# Altium project CC_V1.4.PrjPCB (part 2 of 2)

## Sheet CoreBoard.SchDoc
size A1
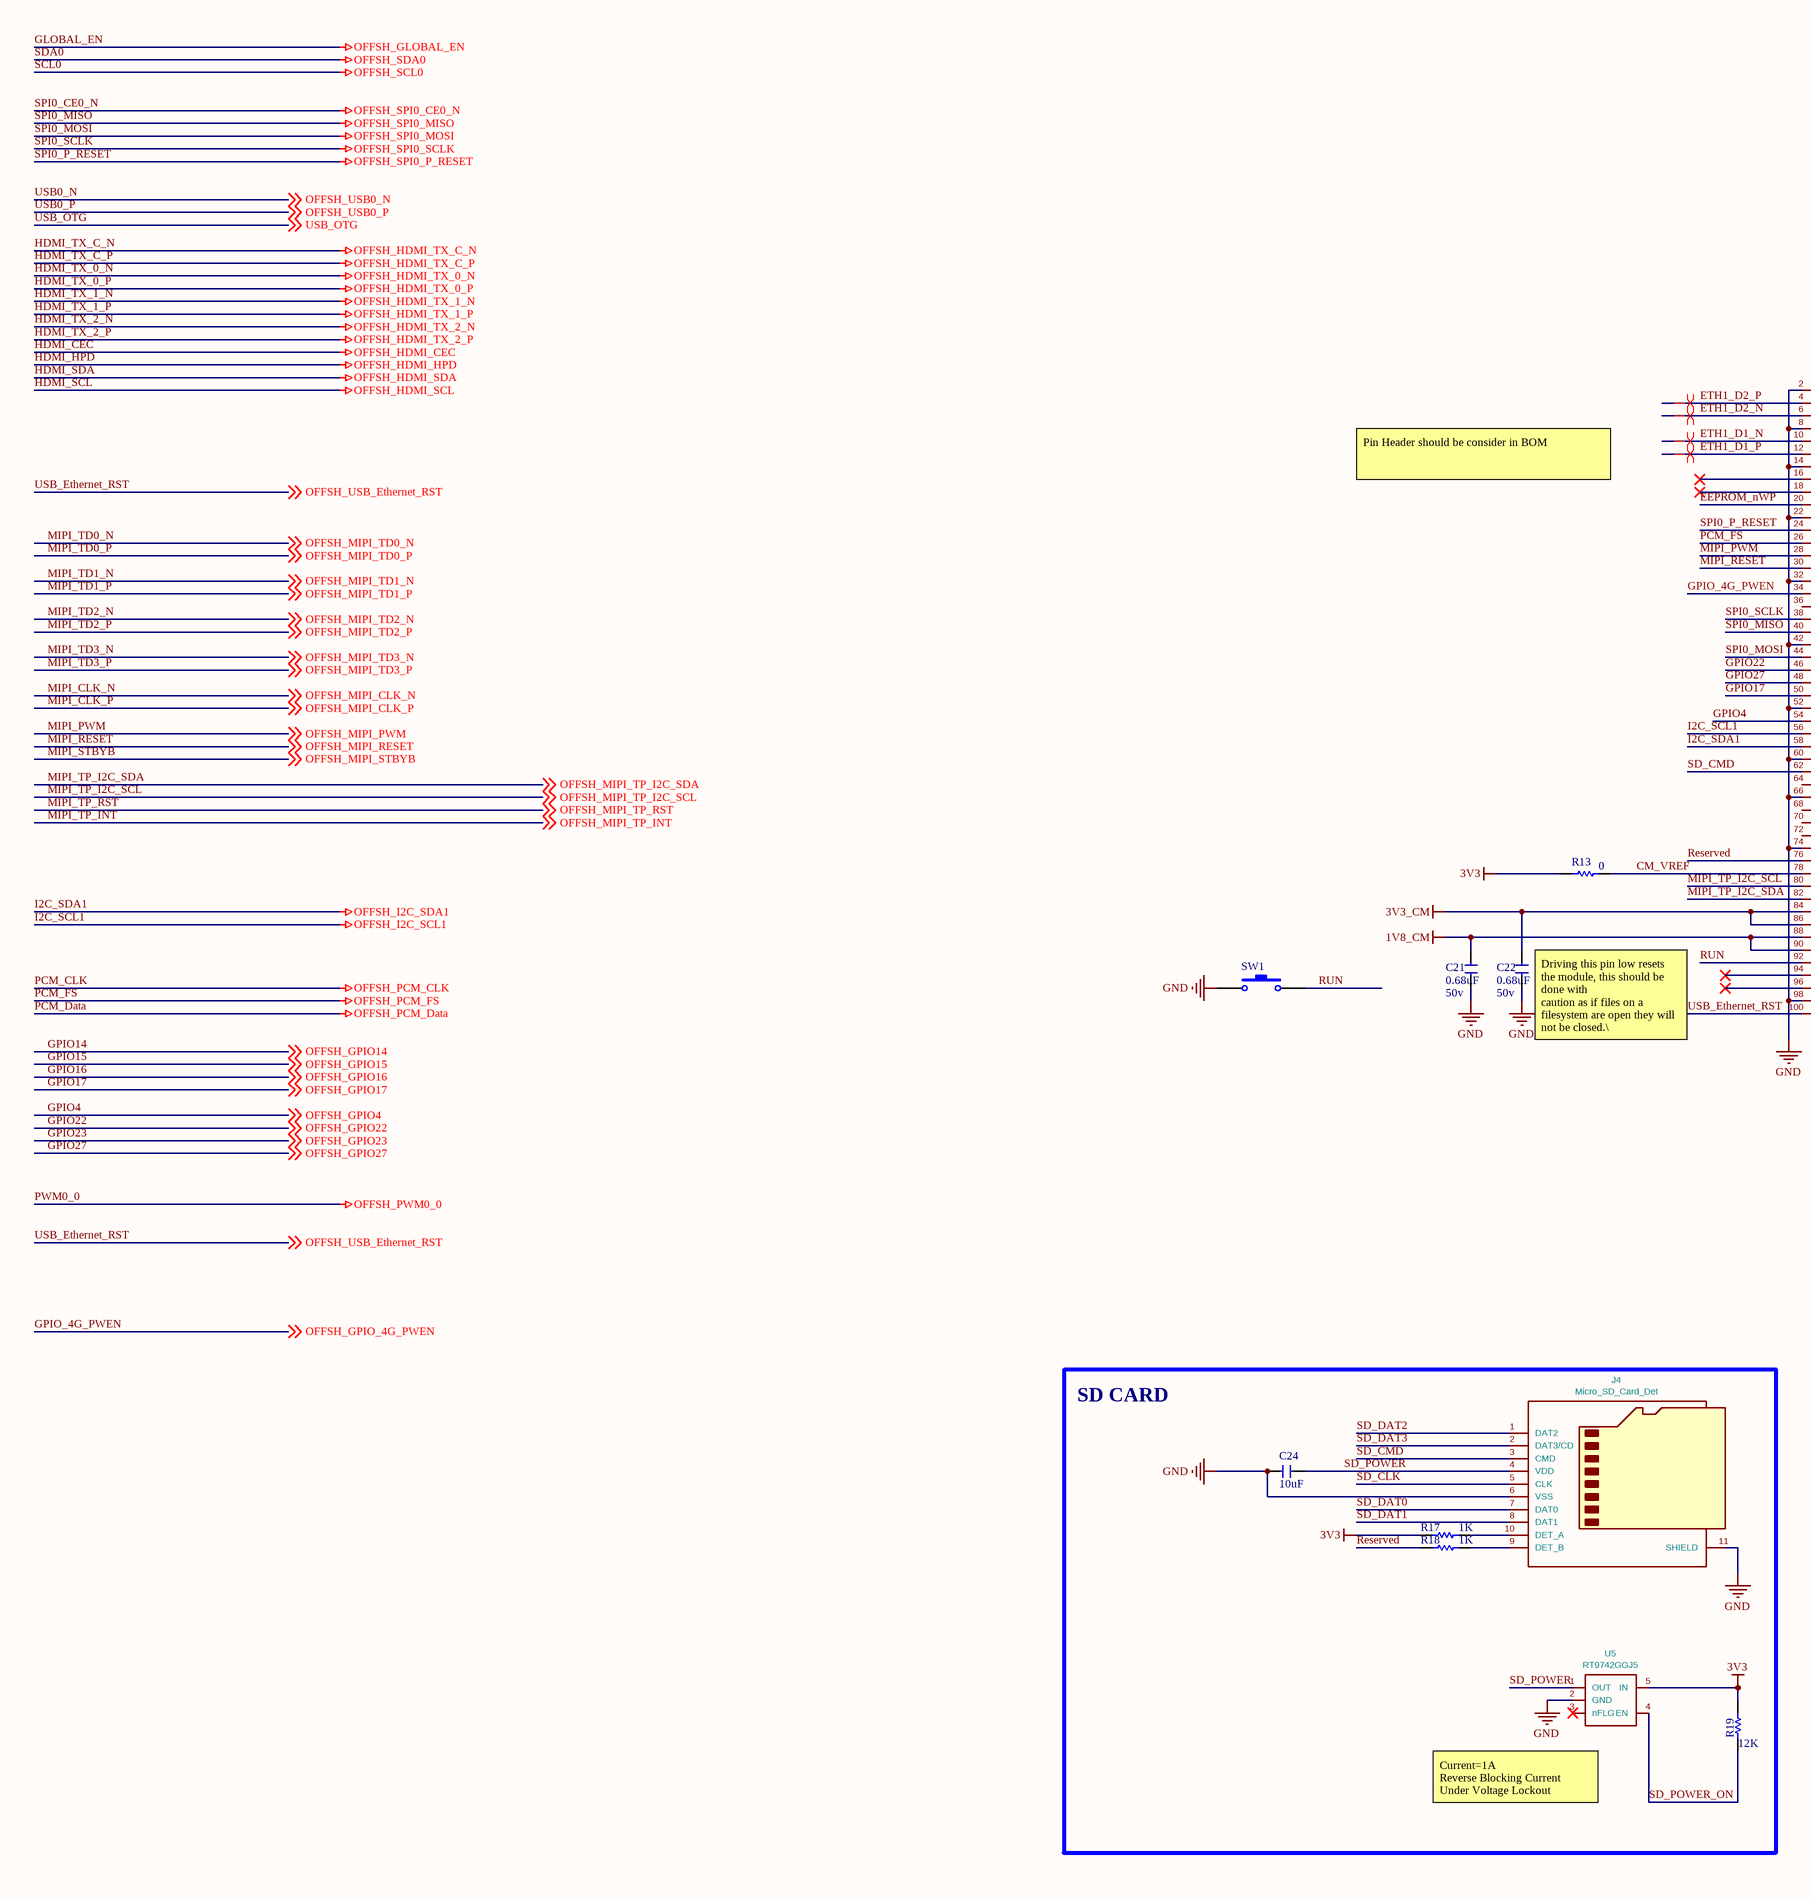
[diagram p15: CoreBoard.SchDoc, left]
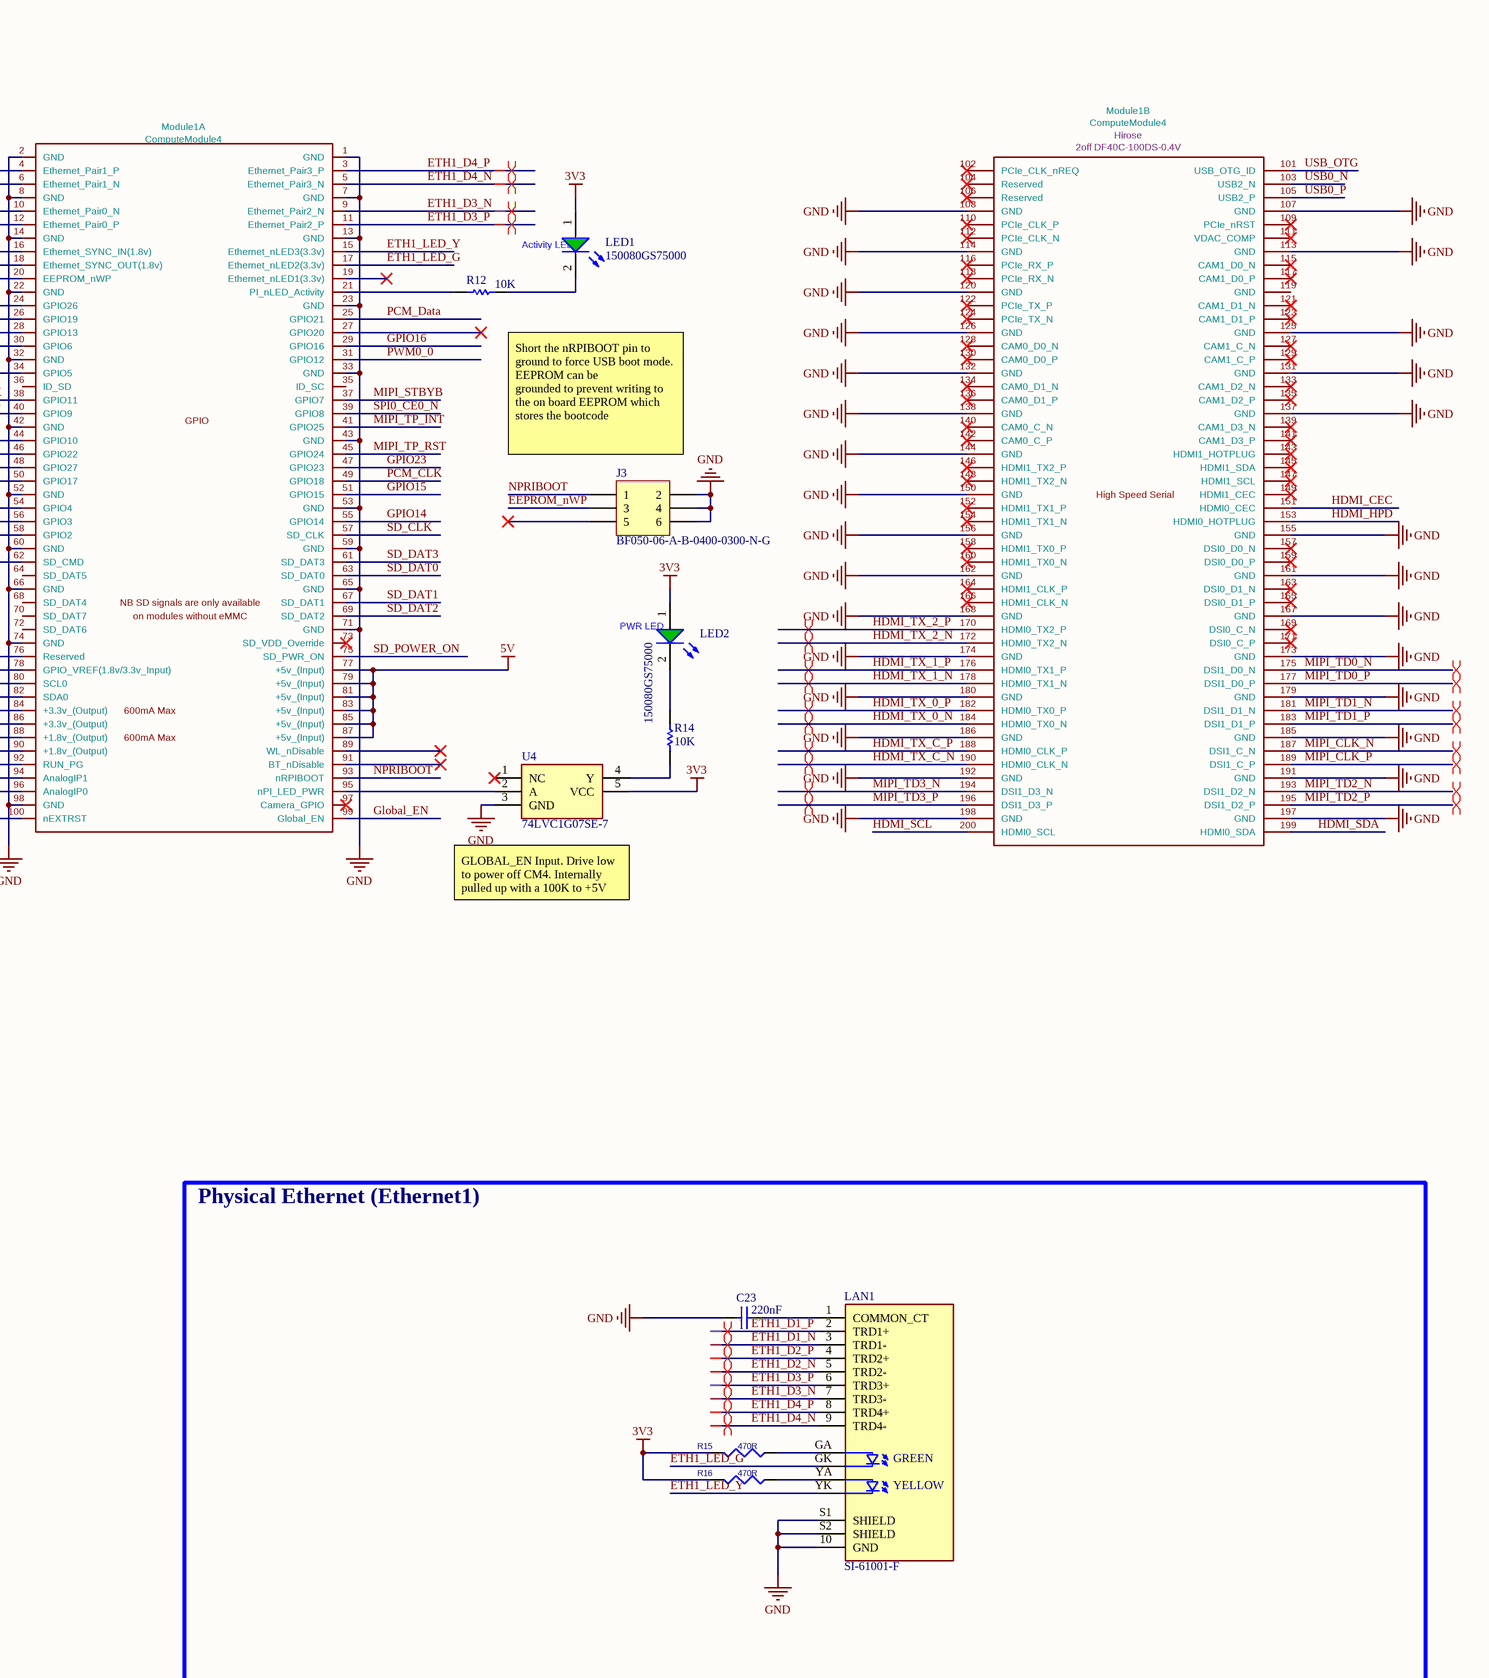
[diagram p16: CoreBoard.SchDoc, right]

### Parts
(Parts that share a designator on the sheet are numbered #1, #2 ... from top to bottom, then left to right.)
C21  value 0.68uF  Voltage: 50v  [0603 Capacitor]  (hidden comment: Capacitor SMD)
C22  value 0.68uF  Voltage: 50v  [0603 Capacitor]  (hidden comment: Capacitor SMD)
C23  value 220nF  [CAP (0603)]  (hidden comment: Cap)
C24  value 10uF  [0603 Capacitor]  (hidden comment: Capacitor SMD)
J3#1  Pin Header pitch 2.00 mm, 6 pin  [BF050-06-A-B-0400-0300-N-G]  (value not drawn)
J4#1  Micro_SD_Card_Det  [SDCARD_MOLEX_503398-1892]
LAN1  SI-61001-F  [BEL_SI-61001-F]
LED1  150080GS75000  [LED_0805_Green]
LED2  150080GS75000  [LED_0805_Green]
Module1  ComputeModule4  [Raspberry-Pi-4-Compute-Module]  (parts A,B of 2)
R12  value 10K  [R0603]  (hidden comment: Res)
R13  value 0  [R0603]  (hidden comment: Res)
R14  value 10K  [R0603]  (hidden comment: Res)
R15  470R  [R0603]
R16  470R  [R0603]
R17  value 1K  [R0603]  (hidden comment: Res)
R18  value 1K  [R0603]  (hidden comment: Res)
R19  value 12K  [R0603]  (hidden comment: Res)
SW1  (no value)  [Key_Tak Switch - Push to On]
U4  74LVC1G07SE-7  [SOT65P210X110-5N]
U5#1  RT9742GGJ5  [SOT-23-5]

### Blocks framed on the sheet
SD CARD: C24 J4#1 R17-R19 U5#1
Physical Ethernet (Ethernet1): C23 LAN1 R15 R16

### Nets
1V8_CM: C21.2 Module1.88(+1.8v_(Output)) Module1.90(+1.8v_(Output))
3V3: LED1.1(A) LED2.1(A) R13.2 R15.1 R16.1 R17.2 R19.2 U4.5(VCC) U5#1.5(IN)
3V3_CM: C22.2 Module1.84(+3.3v_(Output)) Module1.86(+3.3v_(Output))
5V: Module1.77(+5v_(Input)) Module1.79(+5v_(Input)) Module1.81(+5v_(Input)) Module1.83(+5v_(Input)) Module1.85(+5v_(Input)) Module1.87(+5v_(Input))
GLOBAL_EN: Module1.99(Global_EN)  [also labelled OFFSH_GLOBAL_EN]
GND: C21.1 C22.1 C23.1 C24.2 J3#1.2 J3#1.4 J3#1.6 J4#1.6(VSS) J4#1.11(SHIELD) LAN1.10(GND) LAN1.S1(SHIELD) LAN1.S2(SHIELD) Module1.1(GND) Module1.2(GND) Module1.7(GND) Module1.8(GND) Module1.13(GND) Module1.14(GND) Module1.22(GND) Module1.23(GND) Module1.32(GND) Module1.33(GND) Module1.42(GND) Module1.43(GND) Module1.52(GND) Module1.53(GND) Module1.59(GND) Module1.60(GND) Module1.65(GND) Module1.66(GND) Module1.71(GND) Module1.74(GND) Module1.98(GND) Module1.107(GND) Module1.108(GND) Module1.113(GND) Module1.114(GND) Module1.120(GND) Module1.125(GND) Module1.126(GND) Module1.131(GND) Module1.132(GND) Module1.137(GND) Module1.138(GND) Module1.144(GND) Module1.150(GND) Module1.155(GND) Module1.156(GND) Module1.161(GND) Module1.162(GND) Module1.167(GND) Module1.168(GND) Module1.173(GND) Module1.174(GND) Module1.179(GND) Module1.180(GND) Module1.185(GND) Module1.186(GND) Module1.191(GND) Module1.192(GND) Module1.197(GND) Module1.198(GND) SW1.1 U4.3(GND) U5#1.2(GND)
HDMI_CEC: Module1.151(HDMI0_CEC)  [also labelled OFFSH_HDMI_CEC]
HDMI_HPD: Module1.153(HDMI0_HOTPLUG)  [also labelled OFFSH_HDMI_HPD]
HDMI_SCL: Module1.200(HDMI0_SCL)  [also labelled OFFSH_HDMI_SCL]
HDMI_SDA: Module1.199(HDMI0_SDA)  [also labelled OFFSH_HDMI_SDA]
HDMI_TX_0_N: Module1.184(HDMI0_TX0_N)  [also labelled OFFSH_HDMI_TX_0_N]
HDMI_TX_0_P: Module1.182(HDMI0_TX0_P)  [also labelled OFFSH_HDMI_TX_0_P]
HDMI_TX_1_N: Module1.178(HDMI0_TX1_N)  [also labelled OFFSH_HDMI_TX_1_N]
HDMI_TX_1_P: Module1.176(HDMI0_TX1_P)  [also labelled OFFSH_HDMI_TX_1_P]
HDMI_TX_2_N: Module1.172(HDMI0_TX2_N)  [also labelled OFFSH_HDMI_TX_2_N]
HDMI_TX_2_P: Module1.170(HDMI0_TX2_P)  [also labelled OFFSH_HDMI_TX_2_P]
HDMI_TX_C_N: Module1.190(HDMI0_CLK_N)  [also labelled OFFSH_HDMI_TX_C_N]
HDMI_TX_C_P: Module1.188(HDMI0_CLK_P)  [also labelled OFFSH_HDMI_TX_C_P]
I2C_SCL1: Module1.56(GPIO3)  [also labelled OFFSH_I2C_SCL1]
I2C_SDA1: Module1.58(GPIO2)  [also labelled OFFSH_I2C_SDA1]
PCM_CLK: Module1.49(GPIO18)  [also labelled OFFSH_PCM_CLK]
PCM_Data: Module1.25(GPIO21)  [also labelled OFFSH_PCM_Data]
PCM_FS: Module1.26(GPIO19)  [also labelled OFFSH_PCM_FS]
PWM0_0: Module1.31(GPIO12)  [also labelled OFFSH_PWM0_0]
SPI0_CE0_N: Module1.39(GPIO8)  [also labelled OFFSH_SPI0_CE0_N]
SPI0_MISO: Module1.40(GPIO9)  [also labelled OFFSH_SPI0_MISO]
SPI0_MOSI: Module1.44(GPIO10)  [also labelled OFFSH_SPI0_MOSI]
SPI0_P_RESET: Module1.24(GPIO26)  [also labelled OFFSH_SPI0_P_RESET]
SPI0_SCLK: Module1.38(GPIO11)  [also labelled OFFSH_SPI0_SCLK]
CM_VREF: Module1.78(GPIO_VREF(1.8v/3.3v_Input)) R13.1
EEPROM_nWP: J3#1.3 Module1.20(EEPROM_nWP)
ETH1_D1_N: LAN1.3(TRD1-) Module1.10(Ethernet_Pair0_N)
ETH1_D1_P: LAN1.2(TRD1+) Module1.12(Ethernet_Pair0_P)
ETH1_D2_N: LAN1.5(TRD2-) Module1.6(Ethernet_Pair1_N)
ETH1_D2_P: LAN1.4(TRD2+) Module1.4(Ethernet_Pair1_P)
ETH1_D3_N: LAN1.7(TRD3-) Module1.9(Ethernet_Pair2_N)
ETH1_D3_P: LAN1.6(TRD3+) Module1.11(Ethernet_Pair2_P)
ETH1_D4_N: LAN1.9(TRD4-) Module1.5(Ethernet_Pair3_N)
ETH1_D4_P: LAN1.8(TRD4+) Module1.3(Ethernet_Pair3_P)
ETH1_LED_G: LAN1.GK Module1.17(Ethernet_nLED2(3.3v))
ETH1_LED_Y: LAN1.YK Module1.15(Ethernet_nLED3(3.3v))
GPIO4: Module1.54(GPIO4) ; off-sheet OFFSH_GPIO4  [also labelled OFFSH_GPIO4]
GPIO14: Module1.55(GPIO14) ; off-sheet OFFSH_GPIO14  [also labelled OFFSH_GPIO14]
GPIO15: Module1.51(GPIO15) ; off-sheet OFFSH_GPIO15  [also labelled OFFSH_GPIO15]
GPIO16: Module1.29(GPIO16) ; off-sheet OFFSH_GPIO16  [also labelled OFFSH_GPIO16]
GPIO17: Module1.50(GPIO17) ; off-sheet OFFSH_GPIO17  [also labelled OFFSH_GPIO17]
GPIO22: Module1.46(GPIO22) ; off-sheet OFFSH_GPIO22  [also labelled OFFSH_GPIO22]
GPIO23: Module1.47(GPIO23) ; off-sheet OFFSH_GPIO23  [also labelled OFFSH_GPIO23]
GPIO27: Module1.48(GPIO27) ; off-sheet OFFSH_GPIO27  [also labelled OFFSH_GPIO27]
GPIO_4G_PWEN: Module1.34(GPIO5) ; off-sheet OFFSH_GPIO_4G_PWEN  [also labelled OFFSH_GPIO_4G_PWEN]
MIPI_CLK_N: Module1.187(DSI1_C_N) ; off-sheet OFFSH_MIPI_CLK_N  [also labelled OFFSH_MIPI_CLK_N]
MIPI_CLK_P: Module1.189(DSI1_C_P) ; off-sheet OFFSH_MIPI_CLK_P  [also labelled OFFSH_MIPI_CLK_P]
MIPI_PWM: Module1.28(GPIO13) ; off-sheet OFFSH_MIPI_PWM  [also labelled OFFSH_MIPI_PWM]
MIPI_RESET: Module1.30(GPIO6) ; off-sheet OFFSH_MIPI_RESET  [also labelled OFFSH_MIPI_RESET]
MIPI_STBYB: Module1.37(GPIO7) ; off-sheet OFFSH_MIPI_STBYB  [also labelled OFFSH_MIPI_STBYB]
MIPI_TD0_N: Module1.175(DSI1_D0_N) ; off-sheet OFFSH_MIPI_TD0_N  [also labelled OFFSH_MIPI_TD0_N]
MIPI_TD0_P: Module1.177(DSI1_D0_P) ; off-sheet OFFSH_MIPI_TD0_P  [also labelled OFFSH_MIPI_TD0_P]
MIPI_TD1_N: Module1.181(DSI1_D1_N) ; off-sheet OFFSH_MIPI_TD1_N  [also labelled OFFSH_MIPI_TD1_N]
MIPI_TD1_P: Module1.183(DSI1_D1_P) ; off-sheet OFFSH_MIPI_TD1_P  [also labelled OFFSH_MIPI_TD1_P]
MIPI_TD2_N: Module1.193(DSI1_D2_N) ; off-sheet OFFSH_MIPI_TD2_N  [also labelled OFFSH_MIPI_TD2_N]
MIPI_TD2_P: Module1.195(DSI1_D2_P) ; off-sheet OFFSH_MIPI_TD2_P  [also labelled OFFSH_MIPI_TD2_P]
MIPI_TD3_N: Module1.194(DSI1_D3_N) ; off-sheet OFFSH_MIPI_TD3_N  [also labelled OFFSH_MIPI_TD3_N]
MIPI_TD3_P: Module1.196(DSI1_D3_P) ; off-sheet OFFSH_MIPI_TD3_P  [also labelled OFFSH_MIPI_TD3_P]
MIPI_TP_I2C_SCL: Module1.80(SCL0) ; off-sheet OFFSH_MIPI_TP_I2C_SCL  [also labelled OFFSH_MIPI_TP_I2C_SCL]
MIPI_TP_I2C_SDA: Module1.82(SDA0) ; off-sheet OFFSH_MIPI_TP_I2C_SDA  [also labelled OFFSH_MIPI_TP_I2C_SDA]
MIPI_TP_INT: Module1.41(GPIO25) ; off-sheet OFFSH_MIPI_TP_INT  [also labelled OFFSH_MIPI_TP_INT]
MIPI_TP_RST: Module1.45(GPIO24) ; off-sheet OFFSH_MIPI_TP_RST  [also labelled OFFSH_MIPI_TP_RST]
NPRIBOOT: J3#1.1 Module1.93(nRPIBOOT)
Reserved: Module1.76(Reserved) R18.2
RUN: Module1.92(RUN_PG) SW1.2
SD_CLK: J4#1.5(CLK) Module1.57(SD_CLK)
SD_CMD: J4#1.3(CMD) Module1.62(SD_CMD)
SD_DAT0: J4#1.7(DAT0) Module1.63(SD_DAT0)
SD_DAT1: J4#1.8(DAT1) Module1.67(SD_DAT1)
SD_DAT2: J4#1.1(DAT2) Module1.69(SD_DAT2)
SD_DAT3: J4#1.2(DAT3/CD) Module1.61(SD_DAT3)
SD_POWER: C24.1 J4#1.4(VDD) U5#1.1(OUT)
SD_POWER_ON: Module1.75(SD_PWR_ON) R19.1 U5#1.4(EN)
USB0_N: Module1.103(USB2_N) ; off-sheet OFFSH_USB0_N  [also labelled OFFSH_USB0_N]
USB0_P: Module1.105(USB2_P) ; off-sheet OFFSH_USB0_P  [also labelled OFFSH_USB0_P]
USB_Ethernet_RST: Module1.100(nEXTRST) ; off-sheet OFFSH_USB_Ethernet_RST  [also labelled OFFSH_USB_Ethernet_RST]
USB_OTG: Module1.101(USB_OTG_ID) ; off-sheet USB_OTG
NetC23_2: C23.2 LAN1.1(COMMON_CT)
NetJ4#1_9: J4#1.9(DET_B) R18.1
NetJ4#1_10: J4#1.10(DET_A) R17.1
NetLAN1_GA: LAN1.GA R15.2
NetLAN1_YA: LAN1.YA R16.2
NetLED1_2: LED1.2(C) R12.1
NetLED2_2: LED2.2(C) R14.1
NetModule1_21: Module1.21(PI_nLED_Activity) R12.2
NetModule1_95: Module1.95(nPI_LED_PWR) U4.2(A)
NetR14_2: R14.2 U4.4(Y)

Not connected (* = marked no-connect by the designer): J3#1 5*; Module1 16(Ethernet_SYNC_IN(1.8v))* 18(Ethernet_SYNC_OUT(1.8v))* 19(Ethernet_nLED1(3.3v))* 27(GPIO20)* 35(ID_SC) 36(ID_SD) 64(SD_DAT5) 68(SD_DAT4) 70(SD_DAT7) 72(SD_DAT6) 73(SD_VDD_Override)* 89(WL_nDisable)* 91(BT_nDisable)* 94(AnalogIP1)* 96(AnalogIP0)* 97(Camera_GPIO)* 102(PCIe_CLK_nREQ)* 104(Reserved)* 106(Reserved)* 109(PCIe_nRST)* 110(PCIe_CLK_P)* 111(VDAC_COMP)* 112(PCIe_CLK_N)* 115(CAM1_D0_N)* 116(PCIe_RX_P)* 117(CAM1_D0_P)* 118(PCIe_RX_N)* 119(GND) 121(CAM1_D1_N)* 122(PCIe_TX_P)* 123(CAM1_D1_P)* 124(PCIe_TX_N)* 127(CAM1_C_N)* 128(CAM0_D0_N)* 129(CAM1_C_P)* 130(CAM0_D0_P)* 133(CAM1_D2_N)* 134(CAM0_D1_N)* 135(CAM1_D2_P)* 136(CAM0_D1_P)* 139(CAM1_D3_N)* 140(CAM0_C_N)* 141(CAM1_D3_P)* 142(CAM0_C_P)* 143(HDMI1_HOTPLUG)* 145(HDMI1_SDA)* 146(HDMI1_TX2_P)* 147(HDMI1_SCL)* 148(HDMI1_TX2_N)* 149(HDMI1_CEC)* 152(HDMI1_TX1_P)* 154(HDMI1_TX1_N)* 157(DSI0_D0_N)* 158(HDMI1_TX0_P)* 159(DSI0_D0_P)* 160(HDMI1_TX0_N)* 163(DSI0_D1_N)* 164(HDMI1_CLK_P)* 165(DSI0_D1_P)* 166(HDMI1_CLK_N)* 169(DSI0_C_N)* 171(DSI0_C_P)*; U4 1(NC)*; U5#1 3(nFLG)*

### Layout directives
differential pair; net class MIPI: MIPI_CLK_N, MIPI_CLK_P, MIPI_TD0_N, MIPI_TD0_P, MIPI_TD1_N, MIPI_TD1_P, MIPI_TD2_N, MIPI_TD2_P
differential pair: ETH1_D1_N, ETH1_D1_P, ETH1_D2_N, ETH1_D2_P, ETH1_D3_N, ETH1_D3_P, ETH1_D4_N, ETH1_D4_P, HDMI_TX_0_N, HDMI_TX_0_P, HDMI_TX_1_N, HDMI_TX_1_P, HDMI_TX_2_N, HDMI_TX_2_P, HDMI_TX_C_N, HDMI_TX_C_P, MIPI_TD3_N, MIPI_TD3_P

### Notes on the sheet
- Pin Header should be consider in BOM
- (near LED1) Activity LED
- Short the nRPIBOOT pin to ground to force USB boot mode.                                                                     EEPROM can be
  grounded to prevent writing to the on board EEPROM which stores the bootcode
- (near LED2) PWR LED
- (near C22) Driving this pin low resets the module, this should be done with
  caution as if files on a filesystem are open they will not be closed.\
- (near U4) GLOBAL_EN Input. Drive low to power off CM4. Internally pulled up with a 100K to +5V
- (near U5#1) Current=1A
  Reverse Blocking Current
  Under Voltage Lockout
- (in symbol ComputeModule4-CM4, part A) GPIO; NB SD signals are only available; on modules without eMMC; 600mA Max
- (in symbol ComputeModule4-CM4, part B) High Speed Serial
- (in symbol SI-61001-F) GREEN; YELLOW

### Library data of the parts
C23 = Cap: as C45 on sheet Power_Supply
C24 = Capacitor SMD: Voltage: 50v
J3#1 = BF050-06-A-B-0400-0300-N-G: Pin Number: 6; Pitch: 2.00 mm; Row Number: Dual; Link: https://gct.co/connector/bf050; Part Number: BF050-06-A-B-0400-0300-N-G
J4#1 = Micro_SD_Card_Det: Part Description: 9 (8 + 1) Position Card Connector microSD™ Surface Mount, Right Angle Gold; Field4: Farnell; Field5: 2358234; Field6: 503398-1892; Field7: Molex; Field8: UCON00512; Value: Micro_SD_Card_Det; Footprint: CM4IO:SDCARD_MOLEX_503398-1892
LAN1 = SI-61001-F: Conn RJ-45 RCP 8 POS 1.27mm Solder RA Thru-Hole 14 Terminal 1 Port; MF: Bel Magnetic Solutions; Value: *; MP: SI-61001-F; Price: None; Availability: Unavailable; Package: None; SnapEDA_Link: https://www.snapeda.com/parts/SI-61001-F/Bel%20Magnetic%20Solutions/view-part/4791152/?ref=snap
LED1 LED2 = WL-SMCW 0805  150080GS75000: as LED5 on sheet Power_Supply; PartNo: 150080GS75000; ComponentLink1Description: Manufacturer; ComponentLink1URL: http://www.we-online.de; Created by: Christin Otto; Created Date: June 2013; ComponentLink2Description: Datasheet; ComponentLink2URL: http://katalog.we-online.com/led/datasheet/150080GS75000.pdf; Color: Green
Module1 = ComputeModule4-CM4: Part Description: 100 Position Connector Receptacle, Center Strip Contacts Surface Mount Gold; Field4: Hirose; Field5: 2off DF40C-100DS-0.4V; Field6: 2off DF40C-100DS-0.4V; Field7: Hirose; Value: ComputeModule4; Footprint: CM4IO:Raspberry-Pi-4-Compute-Module
R12-R14 R17-R19 = Res: Resistor; Published: 8-Jun-2000; LatestRevisionDate: 17-Jul-2002; LatestRevisionNote: Re-released for DXP Platform.; PackageReference: AXIAL-0.3; Publisher: Altium Limited
R15 R16 = RES: Value: 470
SW1 = SW-PB: Switch; Published: 24-Mar-1999; LatestRevisionDate: 17-Jul-2002; LatestRevisionNote: Re-released for DXP Platform.; PackageReference: SPST-2; Publisher: Altium Limited; PackageDescription: Switch; 2 Leads
U4 = 74LVC1G07SE-7: Undefined or Miscellaneous; Manufacturer_Name: Diodes Inc.; Datasheet Link: https://componentsearchengine.com/Datasheets/2/74LVC1G07SE-7.pdf; Height: 1.1mm; Manufacturer_Part_Number: 74LVC1G07SE-7; Mouser Part Number: 621-74LVC1G07SE-7; Mouser Price/Stock: https://www.mouser.co.uk/ProductDetail/Diodes-Incorporated/74LVC1G07SE-7?qs=abZ1nkZpTuNoZmx9wrxFdA%3D%3D; Arrow Part Number: 74LVC1G07SE-7; Arrow Price/Stock: https://www.arrow.com/en/products/74lvc1g07se-7/diodes-incorporated
U5#1 = RT9742GGJ5: Part Description: Power Switch/Driver 1:1 N-Channel 1A TSOT-23-5; Field4: Farnell; Field5: 2545875; Field7: RichTek; Field8: USWI00166; Field6: RT9742GGJ5; Value: RT9742GGJ5; Footprint: Package_TO_SOT_SMD:SOT-23-5

## Sheet 4G.SchDoc
size A2
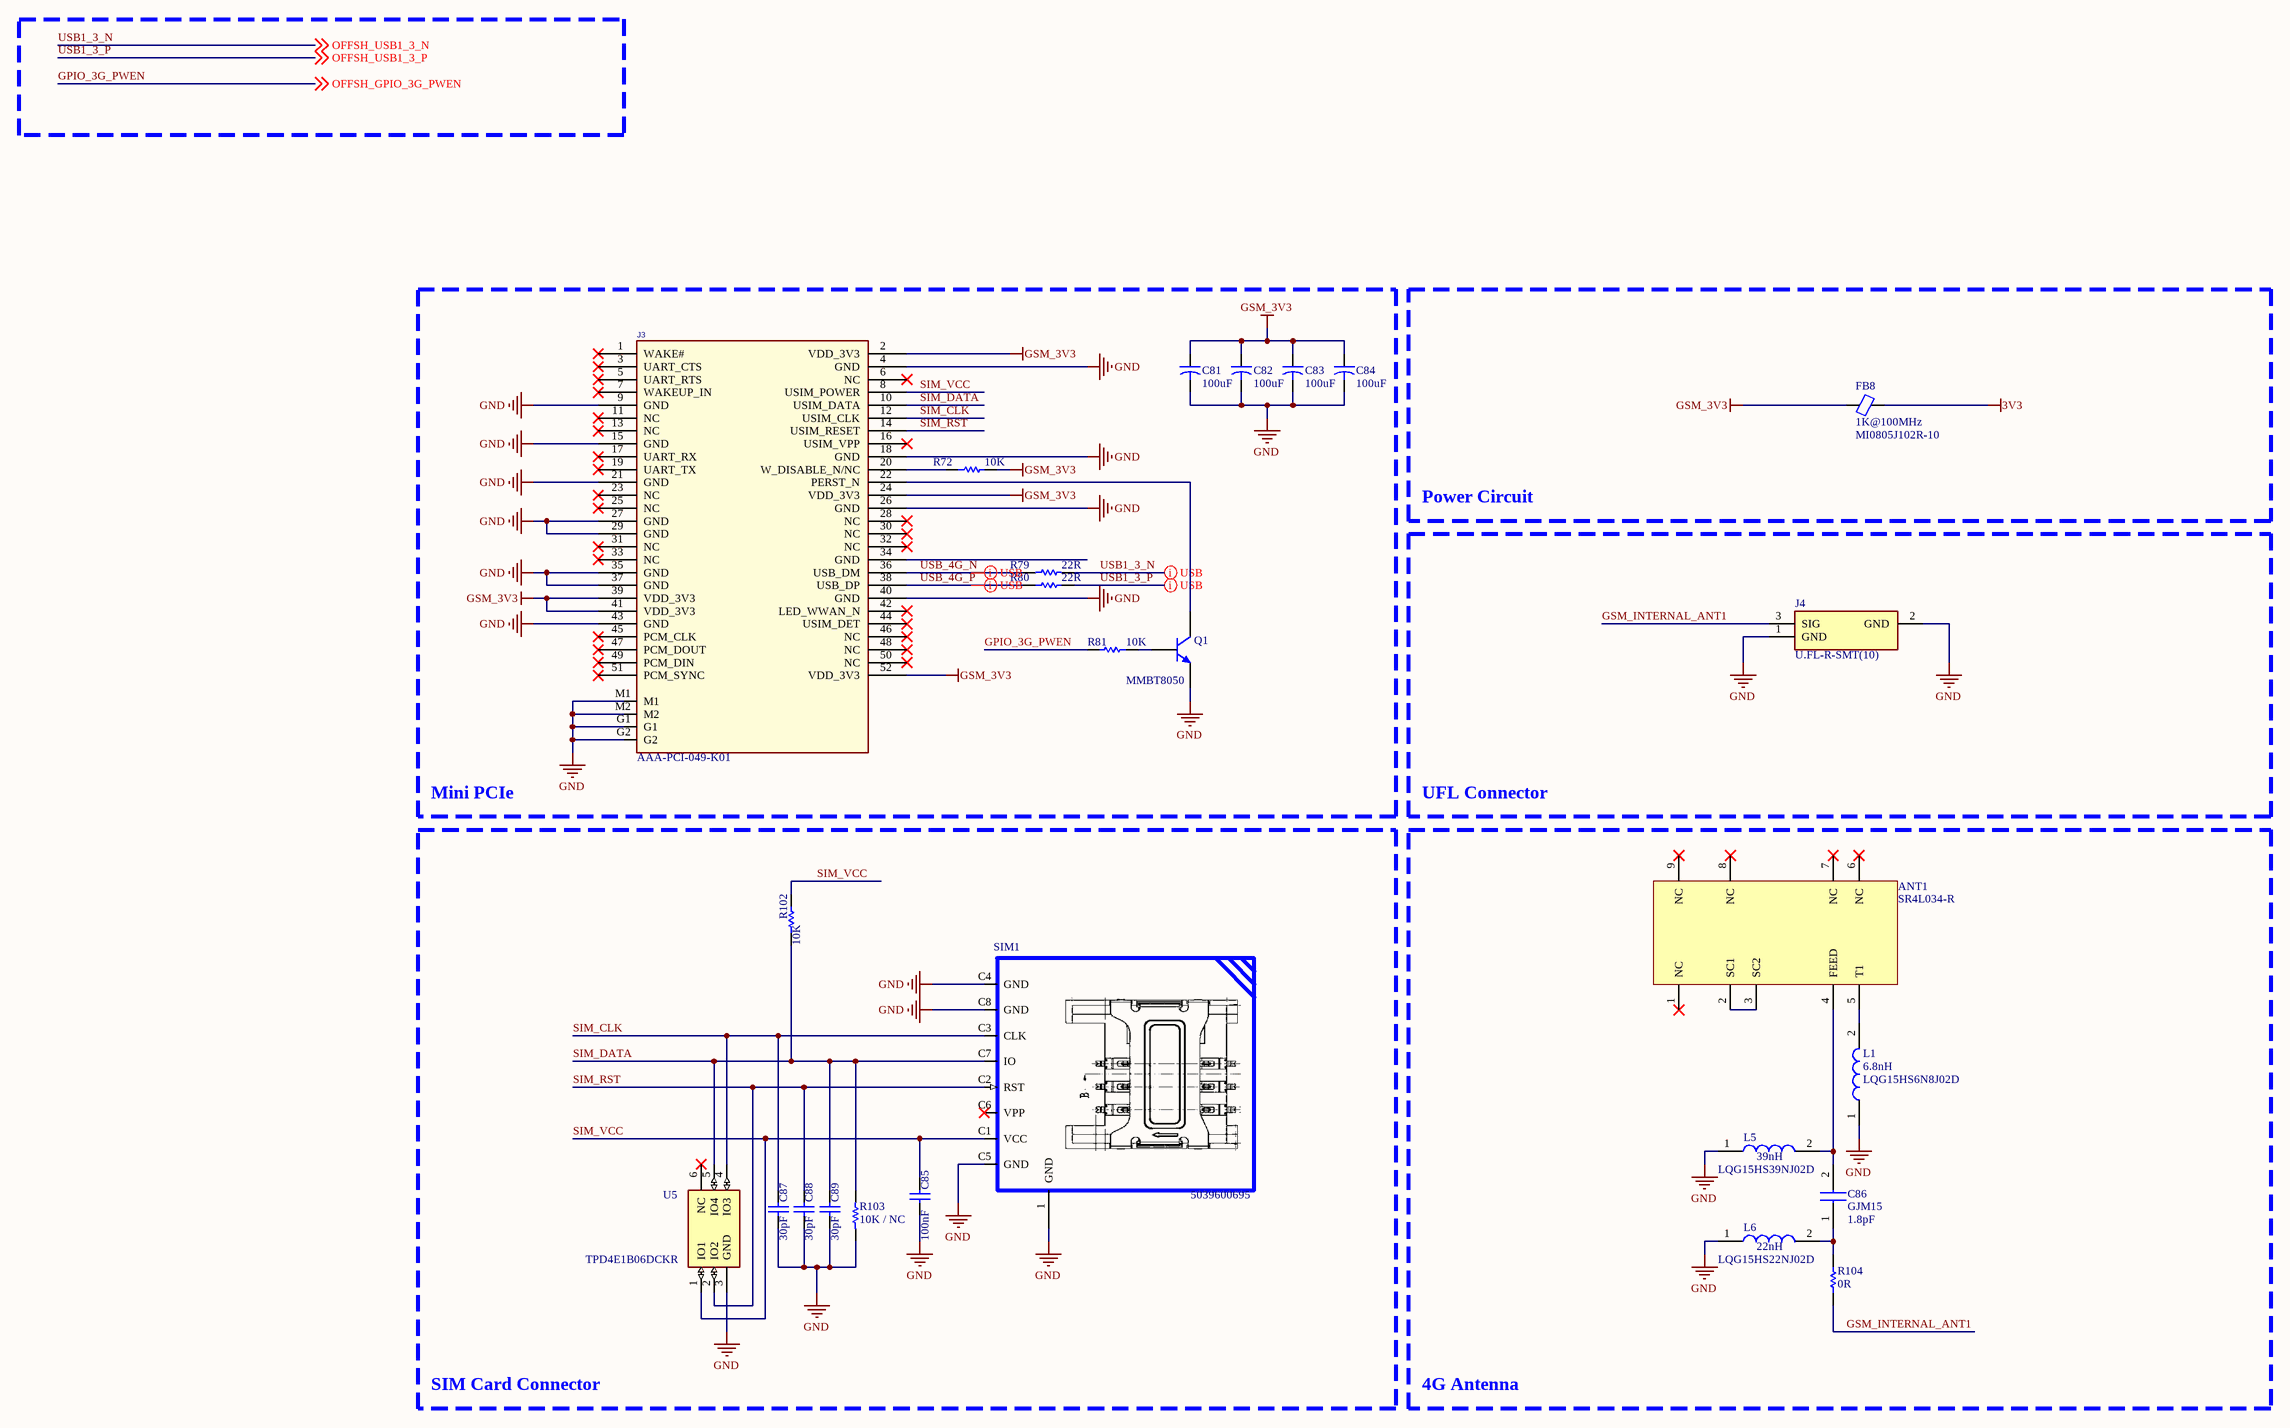
[diagram p17: 4G.SchDoc]

### Parts
(Parts that share a designator on the sheet are numbered #1, #2 ... from top to bottom, then left to right.)
ANT1  4G Antenna  [SR4L034-R]  (value not drawn)
C81#2  value 100uF  [TANTAL (SIZE B)]  (hidden comment: Cap_Tantal)
C82#2  value 100uF  [TANTAL (SIZE B)]  (hidden comment: Cap_Tantal)
C83#2  value 100uF  [TANTAL (SIZE B)]  (hidden comment: Cap_Tantal)
C84#2  value 100uF  [TANTAL (SIZE B)]  (hidden comment: Cap_Tantal)
C85#2  value 100nF  [CAP (0603)]  (hidden comment: Cap)
C86#2  GJM15  value 1.8pF  [GJM15]
C87#2  value 30pF  [CAP (0603)]  (hidden comment: Cap)
C88#2  value 30pF  [CAP (0603)]  (hidden comment: Cap)
C89#2  value 30pF  [CAP (0603)]  (hidden comment: Cap)
FB8#2  value 1K@100MHz  Part Number: MI0805J102R-10  [FB0603]  (hidden comment: Ferrite Bead)
J3#2  Part Number: AAA-PCI-049-K01  [MINI PCIE]  (hidden comment: Mini PCIe)
J4#2  U.FL  [UFLRSMT10]  (value not drawn)
L1#2  value 6.8nH  [LQG15HN]  (hidden comment: LQG15HS6N8J02D)
L5  value 39nH  [LQG15HN]  (hidden comment: LQG15HS39NJ02D)
L6  value 22nH  [LQG15HN]  (hidden comment: LQG15HS22NJ02D)
Q1#2  MMBT8050  [SOT95P237X111-3N (SOT23)]
R72#2  value 10K  [RES (0603)]  (hidden comment: Res)
R79#2  value 22R  [RES (0603)]  (hidden comment: Res)
R80#2  value 22R  [RES (0603)]  (hidden comment: Res)
R81#2  value 10K  [RES (0603)]  (hidden comment: Res)
R102#2  value 10K  [RES (0603)]  (hidden comment: Res)
R103#1  value 10K / NC  [RES (0603)]  (hidden comment: Res)
R104#1  value 0R  [RES (0603)]  (hidden comment: Res)
SIM1  Part Number: 5039600695  [Micro SIM Connector (5039600695)]  (hidden comment: Micro SIM Connector)
U5#2  ESD Protection  [SOT65P210X110-6N (SC70 6L)]  (value not drawn)

### Nets
3V3: FB8#2.2
GND: C81#2.2 C82#2.2 C83#2.2 C84#2.2 C85#2.1 C87#2.1 C88#2.1 C89#2.1 J3#2.4(GND) J3#2.9(GND) J3#2.15(GND) J3#2.18(GND) J3#2.21(GND) J3#2.26(GND) J3#2.27(GND) J3#2.29(GND) J3#2.35(GND) J3#2.37(GND) J3#2.40(GND) J3#2.43(GND) J3#2.G1 J3#2.G2 J3#2.M1 J3#2.M2 J4#2.1(GND) J4#2.2(GND) L1#2.1 L5.1 L6.1 Q1#2.2(E) R103#1.1 SIM1.1(GND) SIM1.C4(GND) SIM1.C5(GND) SIM1.C8(GND) U5#2.3(GND)
GSM_3V3: C81#2.1 C82#2.1 C83#2.1 C84#2.1 FB8#2.1 J3#2.2(VDD_3V3) J3#2.24(VDD_3V3) J3#2.39(VDD_3V3) J3#2.41(VDD_3V3) J3#2.52(VDD_3V3) R72#2.2
GPIO_3G_PWEN: R81#2.2 ; off-sheet OFFSH_GPIO_3G_PWEN  [also labelled OFFSH_GPIO_3G_PWEN]
GSM_INTERNAL_ANT1: J4#2.3(SIG) R104#1.1
SIM_CLK: C87#2.2 J3#2.12(USIM_CLK) SIM1.C3(CLK) U5#2.4(IO3)
SIM_DATA: C89#2.2 J3#2.10(USIM_DATA) R102#2.1 R103#1.2 SIM1.C7(IO) U5#2.5(IO4)
SIM_RST: C88#2.2 J3#2.14(USIM_RESET) SIM1.C2(RST) U5#2.2(IO2)
SIM_VCC: C85#2.2 J3#2.8(USIM_POWER) R102#2.2 SIM1.C1(VCC) U5#2.1(IO1)
USB1_3_N: R79#2.2 ; off-sheet OFFSH_USB1_3_N  [also labelled OFFSH_USB1_3_N]
USB1_3_P: R80#2.2 ; off-sheet OFFSH_USB1_3_P  [also labelled OFFSH_USB1_3_P]
USB_4G_N: J3#2.36(USB_DM) R79#2.1
USB_4G_P: J3#2.38(USB_DP) R80#2.1
NetANT1_2: ANT1.2(SC1) ANT1.3(SC2)
NetANT1_4: ANT1.4(FEED) C86#2.2 L5.2
NetANT1_5: ANT1.5(T1) L1#2.2
NetC86#2_1: C86#2.1 L6.2 R104#1.2
NetJ3#2_20: J3#2.20(W_DISABLE_N/NC) R72#2.1
NetJ3#2_22: J3#2.22(PERST_N) Q1#2.3(C)
NetQ1#2_1: Q1#2.1(B) R81#2.1

Not connected (* = marked no-connect by the designer): ANT1 1(NC)* 6(NC)* 7(NC)* 8(NC)* 9(NC)*; J3#2 1(WAKE#)* 3(UART_CTS)* 5(UART_RTS)* 6(NC)* 7(WAKEUP_IN)* 11(NC)* 13(NC)* 16(USIM_VPP)* 17(UART_RX)* 19(UART_TX)* 23(NC)* 25(NC)* 28(NC)* 30(NC)* 31(NC)* 32(NC)* 33(NC)* 34(GND) 42(LED_WWAN_N)* 44(USIM_DET)* 45(PCM_CLK)* 46(NC)* 47(PCM_DOUT)* 48(NC)* 49(PCM_DIN)* 50(NC)* 51(PCM_SYNC)*; SIM1 C6(VPP)*; U5#2 6(NC)*

### Layout directives
differential pair; net class USB: USB1_3_N, USB1_3_P, USB_4G_N, USB_4G_P

### Notes on the sheet
- Power Circuit
- Mini PCIe
- UFL Connector
- SIM Card Connector
- 4G Antenna

### Library data of the parts
ANT1 = SR4L034-R: LTE antenna / Berand        : antenova / partNo Left : SR4L034-L / PartNo Right: SR4L034-R; Link: https://www.digikey.sg/product-detail/en/antenova/SR4L034-R/627-1107-1-ND/9172247; Part Number: SR4L034-R
C81#2 C82#2 C83#2 C84#2 = Cap_Tantal: Tantalum Capacitor; Voltage: 10V
C85#2 C87#2 C88#2 C89#2 = Cap: SMD capacitor; Voltage: 50V
C86#2 = GJM15: Murata Capacitor; Manufacturer_Name: Murata Electronics; Height: 0.55mm
FB8#2 = Ferrite Bead: Ferrite Bead SMD; Link: https://www.digikey.com/product-detail/en/laird-signal-integrity-products/MI0805J102R-10/240-2551-1-ND/1015989
J3#2 = Mini PCIe (AAA-PCI-049-K01): Link: https://lcsc.com/product-detail/Others_AAA-PCI-049-K01_C185938.html
J4#2 = U.FL-R-SMT(10): Coaxial Connectors U.FL; Manufacturer_Name: Hirose; Datasheet Link: https://media.digikey.com/pdf/Data%20Sheets/Hirose%20PDFs/UFL%20Series.pdf; Height: 1.25mm; Link: https://www.digikey.sg/product-detail/en/hirose-electric-co-ltd/U.FL-R-SMT-10/H9161CT-ND/2135256; Part Number: U.FL-R-SMT(10)
L1#2 = LQG15HS6N8J02D: Murata Inductor; Manufacturer_Name: Murata Electronics; Height: 0.55mm; Link: https://www.digikey.com/product-detail/en/murata-electronics/LQG15HS6N8J02D/490-2621-1-ND/662901; Part Number: LQG15HS6N8J02D
L5 = LQG15HS39NJ02D: Murata Inductor; Manufacturer_Name: Murata Electronics; Height: 0.55mm; Link: https://www.digikey.com/product-detail/en/murata-electronics/LQG15HS39NJ02D/490-2630-1-ND/662910; Part Number: LQG15HS39NJ02D
L6 = LQG15HS22NJ02D: Murata Inductor; Manufacturer_Name: Murata Electronics; Height: 0.55mm; Link: https://www.digikey.com/product-detail/en/murata-electronics/LQG15HS22NJ02D/490-2627-1-ND/662907; Part Number: LQG15HS22NJ02D
Q1#2 = MMBT8050: NPN General Purpose Amplifier; Link: https://www.alibaba.com/product-detail/100-MMBT8050-SOT-23-J3Y-S8050_60584077590.html; Part Number: MMBT8050
R72#2 R79#2 R80#2 R81#2 R102#2 R103#1 R104#1 = Res: SMD resistor; Tolerance: 5%
SIM1 = Micro SIM Connector (5039600695): Micro SIM Card Connector; Link: https://www.digikey.sg/product-detail/en/molex/5039600695/WM17882CT-ND/8572265
U5#2 = TPD4E1B06DCKR: Quad Bi-Directional ESD Protection Array; Manufacturer_Name: Texas Instruments; Datasheet Link: http://www.ti.com/jp/lit/gpn/tpd4e1b06; Height: 1.1mm; Link: https://www.digikey.sg/product-detail/en/texas-instruments/TPD4E1B06DCKR/296-39346-1-ND/5143298; Part Number: TPD4E1B06DCKR

## Sheet LCD.SchDoc
size A2
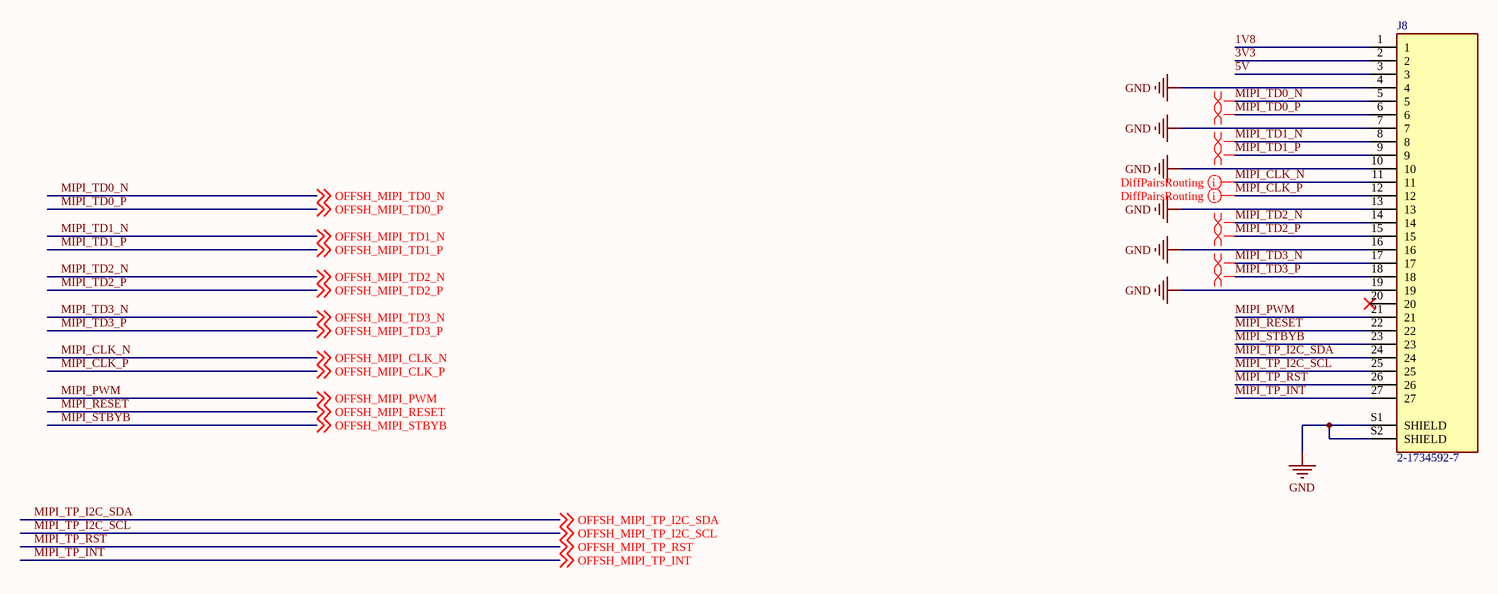
[diagram p18: LCD.SchDoc]

### Parts
J8  2-1734592-7  [TE_2-1734592-7]

### Nets
1V8: J8.1
3V3: J8.2
5V: J8.3
GND: J8.4 J8.7 J8.10 J8.13 J8.16 J8.19 J8.S1(SHIELD) J8.S2(SHIELD)
MIPI_CLK_N: J8.11 ; off-sheet OFFSH_MIPI_CLK_N  [also labelled OFFSH_MIPI_CLK_N]
MIPI_CLK_P: J8.12 ; off-sheet OFFSH_MIPI_CLK_P  [also labelled OFFSH_MIPI_CLK_P]
MIPI_PWM: J8.21 ; off-sheet OFFSH_MIPI_PWM  [also labelled OFFSH_MIPI_PWM]
MIPI_RESET: J8.22 ; off-sheet OFFSH_MIPI_RESET  [also labelled OFFSH_MIPI_RESET]
MIPI_STBYB: J8.23 ; off-sheet OFFSH_MIPI_STBYB  [also labelled OFFSH_MIPI_STBYB]
MIPI_TD0_N: J8.5 ; off-sheet OFFSH_MIPI_TD0_N  [also labelled OFFSH_MIPI_TD0_N]
MIPI_TD0_P: J8.6 ; off-sheet OFFSH_MIPI_TD0_P  [also labelled OFFSH_MIPI_TD0_P]
MIPI_TD1_N: J8.8 ; off-sheet OFFSH_MIPI_TD1_N  [also labelled OFFSH_MIPI_TD1_N]
MIPI_TD1_P: J8.9 ; off-sheet OFFSH_MIPI_TD1_P  [also labelled OFFSH_MIPI_TD1_P]
MIPI_TD2_N: J8.14 ; off-sheet OFFSH_MIPI_TD2_N  [also labelled OFFSH_MIPI_TD2_N]
MIPI_TD2_P: J8.15 ; off-sheet OFFSH_MIPI_TD2_P  [also labelled OFFSH_MIPI_TD2_P]
MIPI_TD3_N: J8.17 ; off-sheet OFFSH_MIPI_TD3_N  [also labelled OFFSH_MIPI_TD3_N]
MIPI_TD3_P: J8.18 ; off-sheet OFFSH_MIPI_TD3_P  [also labelled OFFSH_MIPI_TD3_P]
MIPI_TP_I2C_SCL: J8.25 ; off-sheet OFFSH_MIPI_TP_I2C_SCL  [also labelled OFFSH_MIPI_TP_I2C_SCL]
MIPI_TP_I2C_SDA: J8.24 ; off-sheet OFFSH_MIPI_TP_I2C_SDA  [also labelled OFFSH_MIPI_TP_I2C_SDA]
MIPI_TP_INT: J8.27 ; off-sheet OFFSH_MIPI_TP_INT  [also labelled OFFSH_MIPI_TP_INT]
MIPI_TP_RST: J8.26 ; off-sheet OFFSH_MIPI_TP_RST  [also labelled OFFSH_MIPI_TP_RST]

Not connected (* = marked no-connect by the designer): J8 20*

### Layout directives
differential pair: MIPI_CLK_N, MIPI_CLK_P, MIPI_TD0_N, MIPI_TD0_P, MIPI_TD1_N, MIPI_TD1_P, MIPI_TD2_N, MIPI_TD2_P, MIPI_TD3_N, MIPI_TD3_P

### Library data of the parts
J8 = 2-1734592-7: Package: None; Price: None; Value: *; MP: 2-1734592-7; Availability: Unavailable

## Sheet DIO.SchDoc
size A2
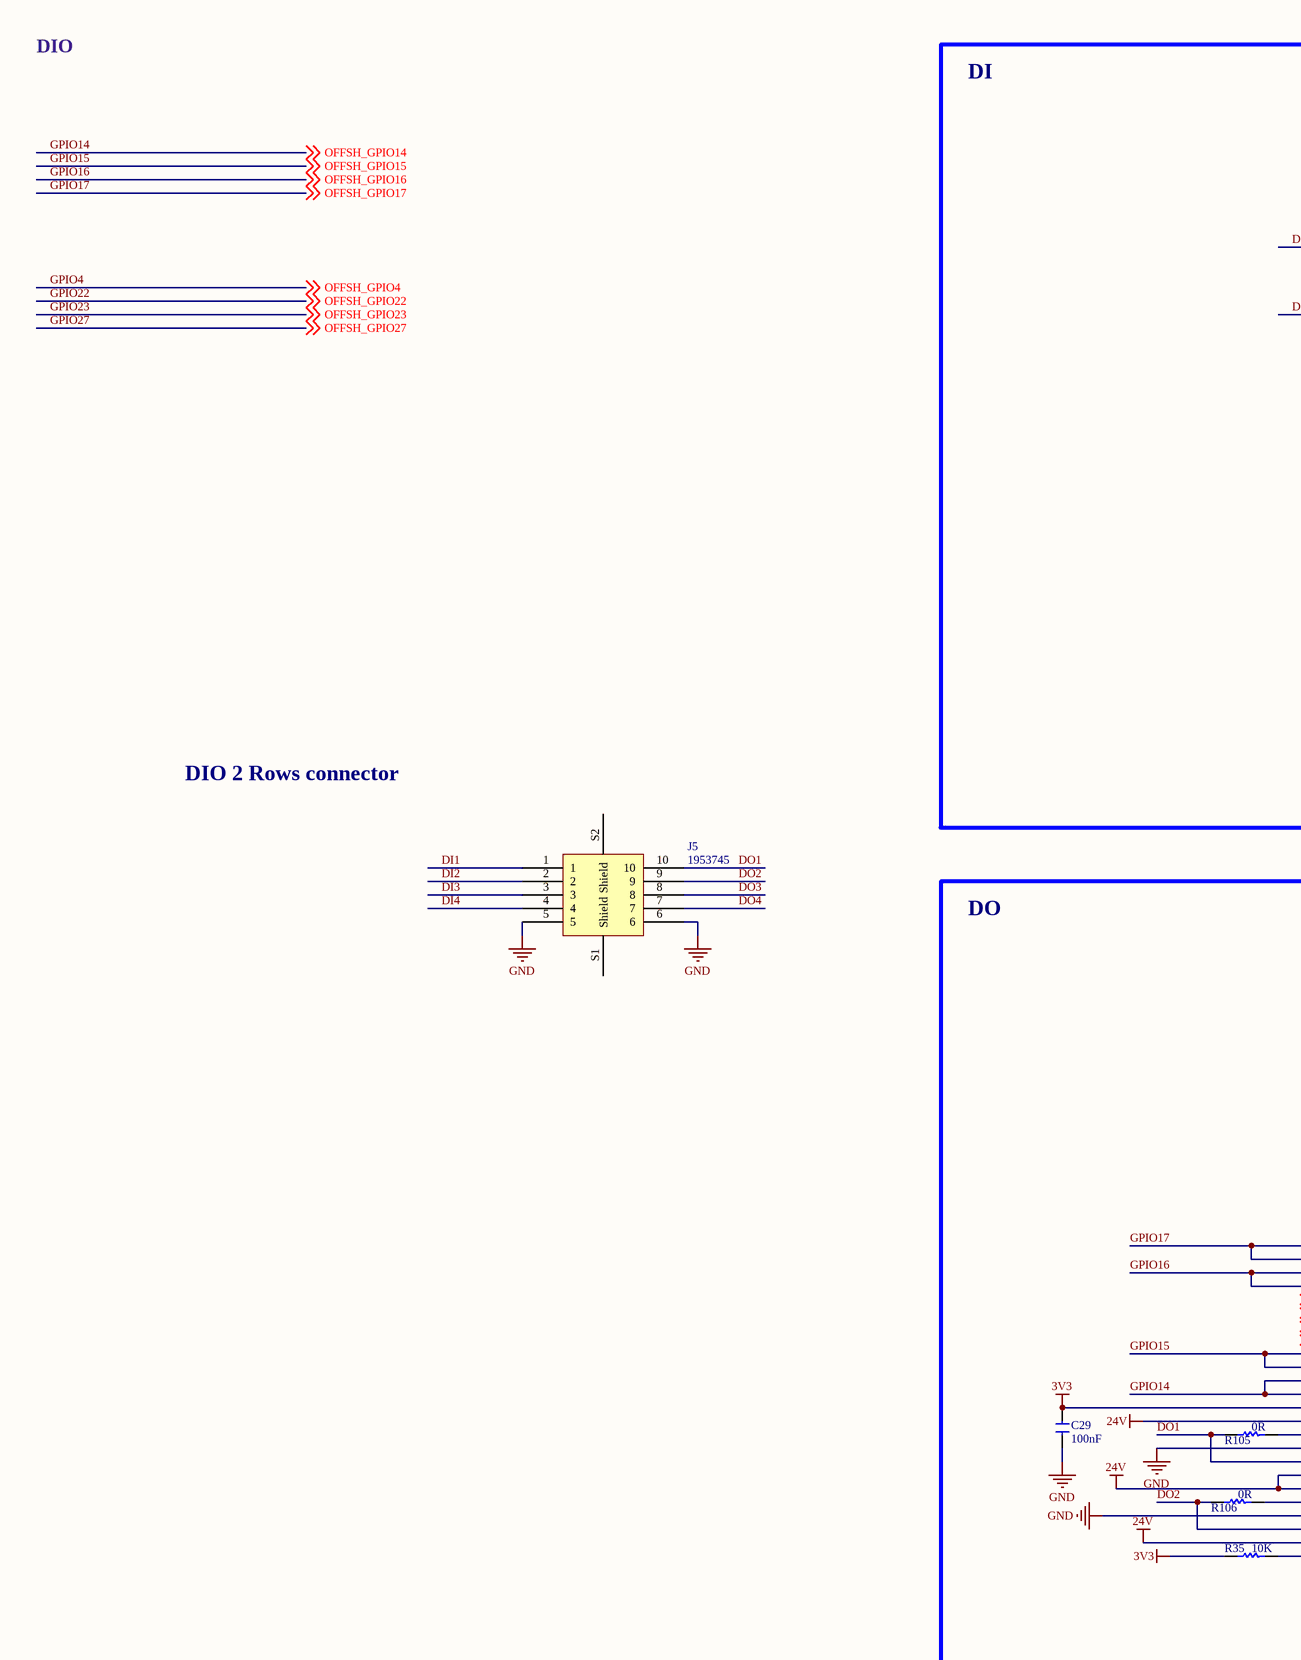
[diagram p19: DIO.SchDoc, left]
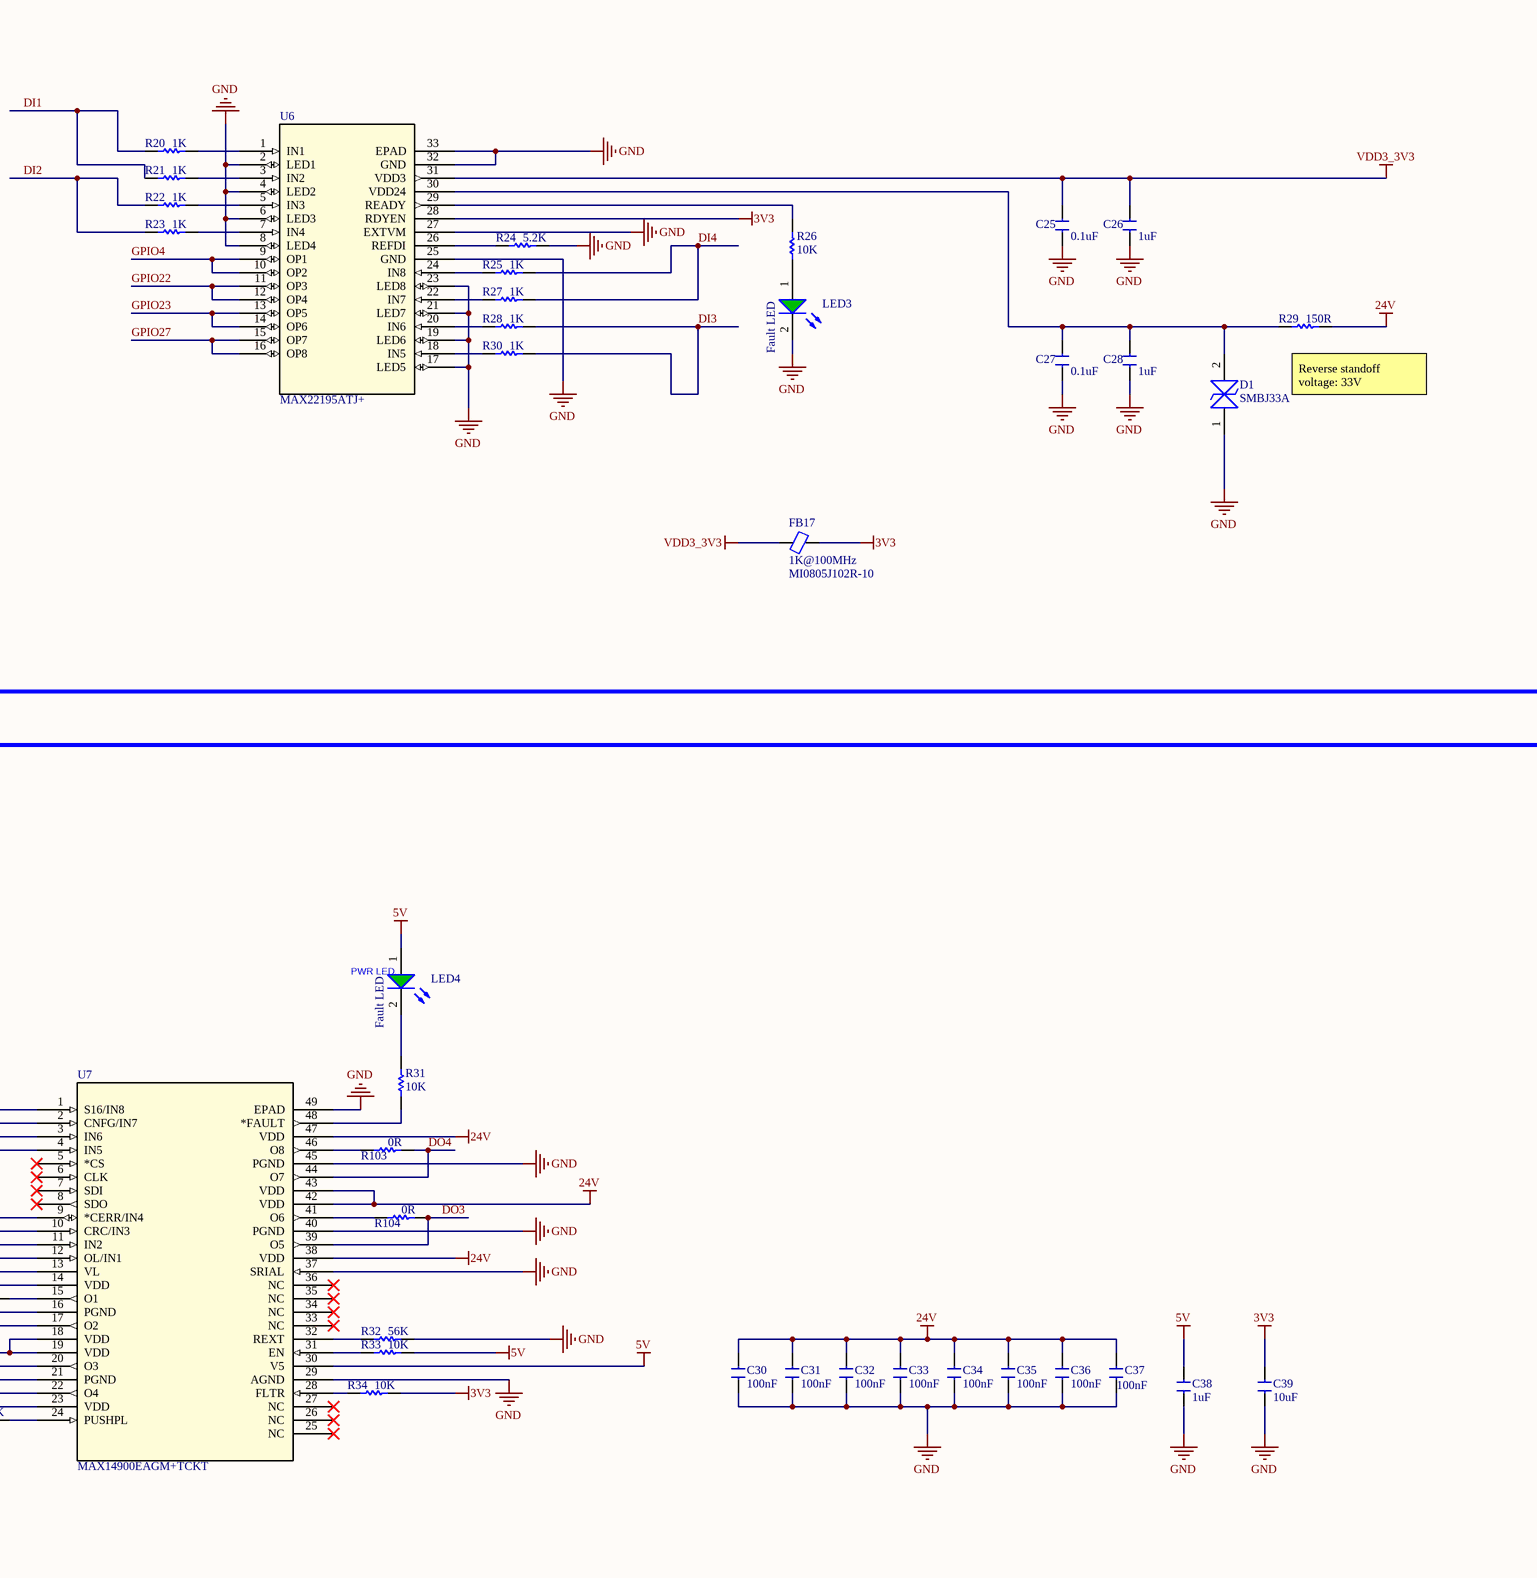
[diagram p20: DIO.SchDoc, right]

### Parts
(Parts that share a designator on the sheet are numbered #1, #2 ... from top to bottom, then left to right.)
C25  value 0.1uF  [0603 Capacitor]  (hidden comment: Ceramic Capacitor SMD)
C26  value 1uF  [0603 Capacitor]  (hidden comment: Ceramic Capacitor SMD)
C27  value 0.1uF  [0603 Capacitor]  (hidden comment: Ceramic Capacitor SMD)
C28  value 1uF  [0603 Capacitor]  (hidden comment: Ceramic Capacitor SMD)
C29  value 100nF  [0603 Capacitor]  (hidden comment: Ceramic Capacitor SMD)
C30  value 100nF  [0603 Capacitor]  (hidden comment: Ceramic Capacitor SMD)
C31  value 100nF  [0603 Capacitor]  (hidden comment: Ceramic Capacitor SMD)
C32  value 100nF  [0603 Capacitor]  (hidden comment: Ceramic Capacitor SMD)
C33  value 100nF  [0603 Capacitor]  (hidden comment: Ceramic Capacitor SMD)
C34  value 100nF  [0603 Capacitor]  (hidden comment: Ceramic Capacitor SMD)
C35  value 100nF  [0603 Capacitor]  (hidden comment: Ceramic Capacitor SMD)
C36  value 100nF  [0603 Capacitor]  (hidden comment: Ceramic Capacitor SMD)
C37  value 100nF  [0603 Capacitor]  (hidden comment: Ceramic Capacitor SMD)
C38  value 1uF  [0603 Capacitor]  (hidden comment: Ceramic Capacitor SMD)
C39  value 10uF  [0603 Capacitor]  (hidden comment: Ceramic Capacitor SMD)
D1  Part Number: SMBJ33A  [DIOM5436X244N (SMB)]  (hidden comment: TVS 8V)
FB17  value 1K@100MHz  Part Number: MI0805J102R-10  [FB0603]  (hidden comment: Ferrite Bead)
J5  1953745  [1953745]
LED3  Fault LED  [LED_0805_Green]
LED4  Fault LED  [LED_0805_Green]
R20  value 1K  [RES (0603)]  (hidden comment: Res)
R21  value 1K  [RES (0603)]  (hidden comment: Res)
R22  value 1K  [RES (0603)]  (hidden comment: Res)
R23  value 1K  [RES (0603)]  (hidden comment: Res)
R24  value 5.2K  [RES (0603)]  (hidden comment: Res)
R25  value 1K  [RES (0603)]  (hidden comment: Res)
R26  value 10K  [RES (0603)]  (hidden comment: Res)
R27  value 1K  [RES (0603)]  (hidden comment: Res)
R28  value 1K  [RES (0603)]  (hidden comment: Res)
R29  value 150R  [RES (0603)]  (hidden comment: Res)
R30  value 1K  [RES (0603)]  (hidden comment: Res)
R31  value 10K  [R0603]  (hidden comment: Res)
R32  value 56K  [RES (0603)]  (hidden comment: Res)
R33  value 10K  [RES (0603)]  (hidden comment: Res)
R34  value 10K  [RES (0603)]  (hidden comment: Res)
R35  value 10K  [RES (0603)]  (hidden comment: Res)
R103#2  value 0R  [RES (0603)]  (hidden comment: Res)
R104#2  value 0R  [RES (0603)]  (hidden comment: Res)
R105  value 0R  [RES (0603)]  (hidden comment: Res)
R106  value 0R  [RES (0603)]  (hidden comment: Res)
U6  MAX22195ATJ+  [21-0140_T3255+6C_MXM]
U7  MAX14900EAGM+TCKT  [21-100009A_K4877+1_MXM]

### Blocks framed on the sheet
DI: C25-C28 D1 FB17 LED3 R20-R30 U6
DO: C29-C39 LED4 R31-R35 R103#2 R104#2 R105 R106 U7

### Nets
3V3: C29.2 C39.2 FB17.2 R34.2 R35.1 U6.28(RDYEN) U7.13(VL)
5V: C38.2 LED4.1(A) R33.2 U7.30(V5)
24V: C30.2 C31.2 C32.2 C33.2 C34.2 C35.2 C36.2 C37.2 R29.2 U7.14(VDD) U7.18(VDD) U7.19(VDD) U7.23(VDD) U7.38(VDD) U7.42(VDD) U7.43(VDD) U7.47(VDD)
GND: C25.1 C26.1 C27.1 C28.1 C29.1 C30.1 C31.1 C32.1 C33.1 C34.1 C35.1 C36.1 C37.1 C38.1 C39.1 D1.1(K) J5.5 J5.6 LED3.2(C) R24.2 R32.2 U6.2(LED1) U6.4(LED2) U6.6(LED3) U6.8(LED4) U6.17(LED5) U6.19(LED6) U6.21(LED7) U6.23(LED8) U6.25(GND) U6.27(EXTVM) U6.32(GND) U6.33(EPAD) U7.16(PGND) U7.21(PGND) U7.29(AGND) U7.37(SRIAL) U7.40(PGND) U7.45(PGND) U7.49(EPAD)
VDD3_3V3: C25.2 C26.2 FB17.1 U6.31(VDD3)
DI1: J5.1 R20.1 R21.1
DI2: J5.2 R22.1 R23.1
DI3: J5.3 R28.2 R30.2
DI4: J5.4 R25.2 R27.2
DO1: J5.10 R105.1 U7.17(O2)
DO2: J5.9 R106.1 U7.22(O4)
DO3: J5.8 R104#2.2 U7.39(O5)
DO4: J5.7 R103#2.2 U7.44(O7)
GPIO4: U6.9(OP1) U6.10(OP2) ; off-sheet OFFSH_GPIO4  [also labelled OFFSH_GPIO4]
GPIO14: U7.11(IN2) U7.12(OL/IN1) ; off-sheet OFFSH_GPIO14  [also labelled OFFSH_GPIO14]
GPIO15: U7.9(*CERR/IN4) U7.10(CRC/IN3) ; off-sheet OFFSH_GPIO15  [also labelled OFFSH_GPIO15]
GPIO16: U7.3(IN6) U7.4(IN5) ; off-sheet OFFSH_GPIO16  [also labelled OFFSH_GPIO16]
GPIO17: U7.1(S16/IN8) U7.2(CNFG/IN7) ; off-sheet OFFSH_GPIO17  [also labelled OFFSH_GPIO17]
GPIO22: U6.11(OP3) U6.12(OP4) ; off-sheet OFFSH_GPIO22  [also labelled OFFSH_GPIO22]
GPIO23: U6.13(OP5) U6.14(OP6) ; off-sheet OFFSH_GPIO23  [also labelled OFFSH_GPIO23]
GPIO27: U6.15(OP7) U6.16(OP8) ; off-sheet OFFSH_GPIO27  [also labelled OFFSH_GPIO27]
NetC27_2: C27.2 C28.2 D1.2(A) R29.1 U6.30(VDD24)
NetLED3_1: LED3.1(A) R26.1
NetLED4_2: LED4.2(C) R31.1
NetR20_2: R20.2 U6.1(IN1)
NetR21_2: R21.2 U6.3(IN2)
NetR22_2: R22.2 U6.5(IN3)
NetR23_2: R23.2 U6.7(IN4)
NetR24_1: R24.1 U6.26(REFDI)
NetR25_1: R25.1 U6.24(IN8)
NetR26_2: R26.2 U6.29(READY)
NetR27_1: R27.1 U6.22(IN7)
NetR28_1: R28.1 U6.20(IN6)
NetR30_1: R30.1 U6.18(IN5)
NetR31_2: R31.2 U7.48(*FAULT)
NetR32_1: R32.1 U7.32(REXT)
NetR33_1: R33.1 U7.31(EN)
NetR34_1: R34.1 U7.28(FLTR)
NetR35_2: R35.2 U7.24(PUSHPL)
NetR103#2_1: R103#2.1 U7.46(O8)
NetR104#2_1: R104#2.1 U7.41(O6)
NetR105_2: R105.2 U7.15(O1)
NetR106_2: R106.2 U7.20(O3)

Not connected (* = marked no-connect by the designer): J5 S1(Shield) S2(Shield); U7 5(*CS)* 6(CLK)* 7(SDI)* 8(SDO)* 25(NC)* 26(NC)* 27(NC)* 33(NC)* 34(NC)* 35(NC)* 36(NC)*

### Notes on the sheet
- DIO
- (near R29) Reverse standoff voltage: 33V
- DIO 2 Rows connector
- (near LED4) PWR LED

### Library data of the parts
C25-C39 = Capacitor Ceramic SMD: Voltage: 10v; Tolerance: *%
D1 = SMBJ6.0CA: Bidirectional TVS 8V SMB; Manufacturer_Name: Littelfuse; Datasheet Link: https://www.littelfuse.com/~/media/electronics/datasheets/tvs_diodes/littelfuse_tvs_diode_smbj_datasheet.pdf.pdf; Height: 2.44mm; Link: https://www.digikey.sg/product-detail/en/littelfuse-inc/SMBJ6.0CA/SMBJ6.0CALFCT-ND/286102
FB17 = Ferrite Bead: Ferrite Bead SMD; Link: https://www.digikey.com/product-detail/en/laird-signal-integrity-products/MI0805J102R-10/240-2551-1-ND/1015989
LED3 LED4 = WL-SMCW 0805  150080GS75000: SMD mono-color Chip LED, WL-SMCW, Green; Manufacturer: W黵th Elektronik eiSos GmbH; PartNo: 150080GS75000; ComponentLink1Description: Manufacturer; ComponentLink1URL: http://www.we-online.de; Created by: Christin Otto; Created Date: June 2013; ComponentLink2Description: Datasheet; ComponentLink2URL: http://katalog.we-online.com/led/datasheet/150080GS75000.pdf; Color: Green
R20-R30 R32-R35 R103#2 R104#2 R105 R106 = Res: SMD resistor; Tolerance: 5%
R31 = Res: Resistor; Published: 8-Jun-2000; LatestRevisionDate: 17-Jul-2002; LatestRevisionNote: Re-released for DXP Platform.; PackageReference: AXIAL-0.3; Publisher: Altium Limited
U6 = MAX22195ATJ+: Parallel Digital Input; Built_By: EMA_UL_Team; Vendor: Maxim Integrated Products; SourceLibrary: Update_to_database_2021-06-01; Copyright: Copyright (C) 2018 Accelerated Designs. All rights reserved; Manufacturer_Part_Number: MAX22195ATJ+; Revision: 4; RefDes: RefDes; Type: DEV
U7 = MAX14900EAGM+TCKT: No Description Available; Vendor: Maxim Integrated Products; Built_By: EMA_UL_Team; SourceLibrary: Maxim_2017-04-18; Manufacturer_Part_Number: MAX14900EAGM+TCKT; Copyright: Copyright (C) 2018 Accelerated Designs. All rights reserved; Revision: 2; RefDes: RefDes; Type: DEV

## Sheet Audio.SchDoc
size A2
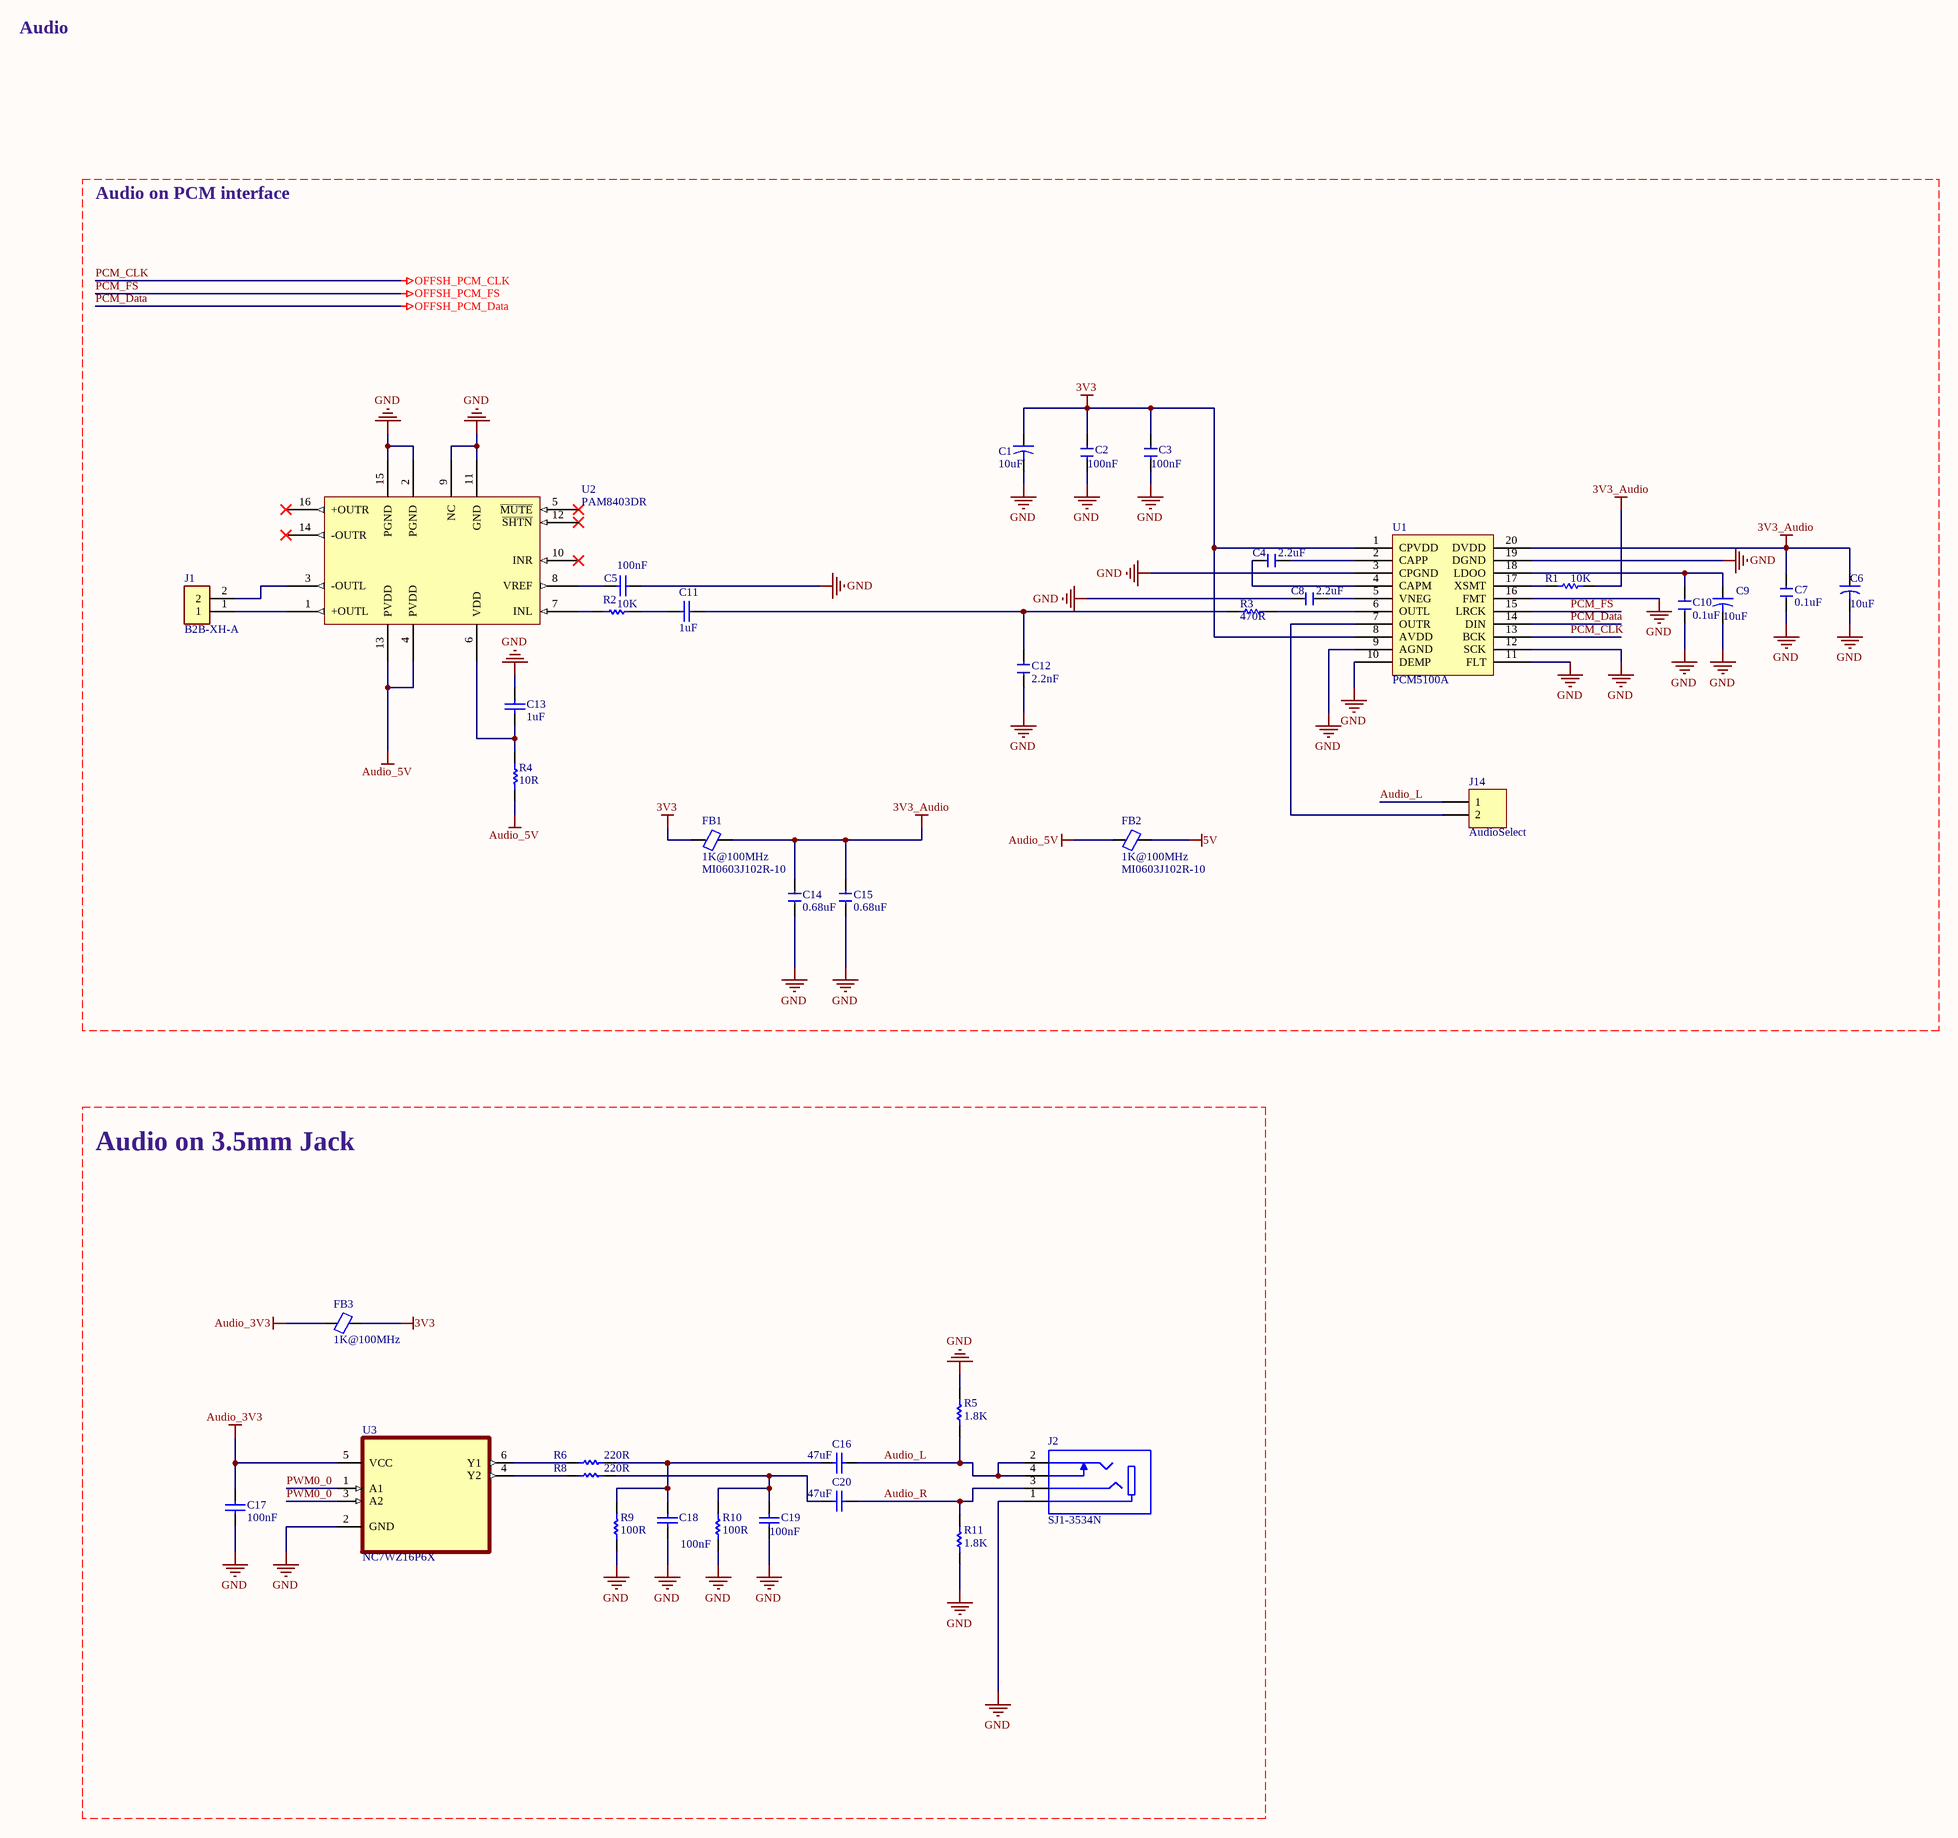
[diagram p21: Audio.SchDoc]

### Parts
C1  value 10uF  [TANTAL (SIZE B)]  (hidden comment: Cap_Tantal)
C2  value 100nF  [0603 Capacitor]  (hidden comment: Ceramic Capacitor SMD)
C3  value 100nF  [0603 Capacitor]  (hidden comment: Ceramic Capacitor SMD)
C4  value 2.2uF  [0603 Capacitor]  (hidden comment: Ceramic Capacitor SMD)
C5  value 100nF  [CAP (0603)]  (hidden comment: Cap)
C6  value 10uF  [TANTAL (SIZE B)]  (hidden comment: Cap_Tantal)
C7  value 0.1uF  [0603 Capacitor]  (hidden comment: Ceramic Capacitor SMD)
C8  value 2.2uF  [0603 Capacitor]  (hidden comment: Ceramic Capacitor SMD)
C9  value 10uF  [TANTAL (SIZE B)]  (hidden comment: Cap_Tantal)
C10  value 0.1uF  [0603 Capacitor]  (hidden comment: Ceramic Capacitor SMD)
C11  value 1uF  [CAP (0603)]  (hidden comment: Cap)
C12  value 2.2nF  [0603 Capacitor]  (hidden comment: Ceramic Capacitor SMD)
C13  value 1uF  [CAP (0603)]  (hidden comment: Cap)
C14  value 0.68uF  [0603 Capacitor]  (hidden comment: Capacitor SMD)
C15  value 0.68uF  [0603 Capacitor]  (hidden comment: Capacitor SMD)
C16  value 47uF  [CAP (0805)]  (hidden comment: Cap)
C17  value 100nF  [CAP (0603)]  (hidden comment: Cap)
C18  value 100nF  [CAP (0603)]  (hidden comment: Cap)
C19  value 100nF  [CAP (0603)]  (hidden comment: Cap)
C20  value 47uF  [CAP (0805)]  (hidden comment: Cap)
FB1  value 1K@100MHz  Part Number: MI0603J102R-10  [FB0603]  (hidden comment: Ferrite Bead)
FB2  value 1K@100MHz  Part Number: MI0603J102R-10  [FB0603]  (hidden comment: Ferrite Bead)
FB3  MI0603J102R-10: 1K@100MHz  [FB0603]  (hidden comment: Ferrite Bead)
J1  XH Connector  [B2B-XH-A]  (value not drawn)
J2  SJ1-3534N  [CUI_SJ1-3534N]
J14  AudioSelect  [HDR1X2]
R1  value 10K  [R0603]  (hidden comment: Res)
R2  value 10K  [RES (0603)]  (hidden comment: Res)
R3  470R  [R0603]
R4  value 10R  [RES (0603)]  (hidden comment: Res)
R5  value 1.8K  [RES (0603)]  (hidden comment: Res)
R6  value 220R  [RES (0603)]  (hidden comment: Res)
R8  value 220R  [RES (0603)]  (hidden comment: Res)
R9  value 100R  [RES (0603)]  (hidden comment: Res)
R10  value 100R  [RES (0603)]  (hidden comment: Res)
R11  value 1.8K  [RES (0603)]  (hidden comment: Res)
U1  PCM5100A  [SOP65P640X120-20N]
U2  Audio Amp  [SOIC127P605X175-16N (SOIC16)]  (value not drawn)
U3  NC7WZ16P6X  [SOT65P210X110-6N]

### Nets
3V3: C1.1 C2.2 C3.2 FB1.1 FB3.2 U1.1(CPVDD) U1.8(AVDD)
3V3_Audio: C6.1 C7.2 C14.1 C15.1 FB1.2 R1.1 U1.20(DVDD)
5V: FB2.2
Audio_3V3: C17.1 FB3.1 U3.5(VCC)
Audio_5V: FB2.1 R4.2 U2.4(PVDD) U2.13(PVDD)
GND: C1.2 C2.1 C3.1 C5.2 C6.2 C7.1 C8.2 C9.2 C10.1 C12.1 C13.1 C14.2 C15.2 C17.2 C18.2 C19.2 J2.1 R5.2 R9.1 R10.1 R11.1 U1.3(CPGND) U1.9(AGND) U1.10(DEMP) U1.11(FLT) U1.12(SCK) U1.16(FMT) U1.19(DGND) U2.2(PGND) U2.9(NC) U2.11(GND) U2.15(PGND) U3.2(GND)
PCM_CLK: U1.13(BCK)  [also labelled OFFSH_PCM_CLK]
PCM_Data: U1.14(DIN)  [also labelled OFFSH_PCM_Data]
PCM_FS: U1.15(LRCK)  [also labelled OFFSH_PCM_FS]
PWM0_0: U3.1(A1) U3.3(A2)
Audio_L: C16.1 J2.2 J2.4 J14.1 R5.1
Audio_R: C20.1 J2.3 R11.2
NetC4_1: C4.1 U1.2(CAPP)
NetC4_2: C4.2 U1.4(CAPM)
NetC5_1: C5.1 U2.8(VREF)
NetC8_1: C8.1 U1.5(VNEG)
NetC9_1: C9.1 C10.2 U1.18(LDOO)
NetC11_1: C11.1 R2.1
NetC11_2: C11.2 C12.2 R3.2
NetC13_2: C13.2 R4.1 U2.6(VDD)
NetC16_2: C16.2 C18.1 R6.2 R9.2
NetC19_1: C19.1 C20.2 R8.2 R10.2
NetJ1_1: J1.1 U2.1(+OUTL)
NetJ1_2: J1.2 U2.3(-OUTL)
NetJ14_2: J14.2 U1.7(OUTR)
NetR1_2: R1.2 U1.17(XSMT)
NetR2_2: R2.2 U2.7(INL)
NetR3_1: R3.1 U1.6(OUTL)
NetR6_1: R6.1 U3.6(Y1)
NetR8_1: R8.1 U3.4(Y2)

Not connected (* = marked no-connect by the designer): U2 5(~{MUTE})* 10(INR)* 12(~{SHTN})* 14(-OUTR)* 16(+OUTR)*

### Notes on the sheet
- Audio
- Audio on PCM interface
- Audio on 3.5mm Jack

### Library data of the parts
C1 C9 = Cap_Tantal: Tantalum Capacitor; Voltage: 10V
  C9: Part Number: Cap_Tantal
C2-C4 C7 C8 C10 C12 = Capacitor Ceramic SMD: Voltage: 10v; Tolerance: *%
C5 C13 C17-C19 = Cap: SMD capacitor; Part Number: SMD CAP (0603); Voltage: 50V
C6 = Cap_Tantal: Tantalum Capacitor; Part Number: Tantal; Voltage: 10V
C11 = Cap: SMD capacitor; part Number: SMD CAP (0603); Voltage: 50V
C14 C15 = Capacitor SMD: Voltage: 50v
C16 C20 = Cap: SMD capacitor; Voltage: 50V
FB1-FB3 = Ferrite Bead: Ferrite Bead SMD; Link: https://www.digikey.com/product-detail/en/laird-signal-integrity-products/MI0805J102R-10/240-2551-1-ND/1015989
J1 = B2B-XH-A: Header Through Hole 2 position (2.50mm); Manufacturer_Name: JST Sales America; Datasheet Link: http://www.jst-mfg.com/product/pdf/eng/eXH.pdf; Height: 7mm; Link: https://www.digikey.sg/product-detail/en/jst-sales-america-inc/B2B-XH-A-LF-SN/455-2247-ND/1651045; Part Number: B2B-XH-A
J2 = SJ1-3534N: 3,5 Ð¼Ð¼, ÑÑ‚ÐµÑ€ÐµÐ¾, Ð¿Ñ€ÑÐ¼Ð¾Ð¹ ÑƒÐ³Ð¾Ð», ÑÐºÐ²Ð¾Ð·Ð½Ð¾Ðµ Ð¾Ñ‚Ð²ÐµÑ€ÑÑ‚Ð¸Ðµ, Ð°ÑƒÐ´Ð¸Ð¾Ñ€Ð°Ð·ÑŠÐµÐ¼; MF: CUI Devices; SnapEDA_Link: https://www.snapeda.com/parts/SJ1-3534N/CUI%20Devices/view-part/576149/?ref=snap; Availability: Unavailable; Value: *; Price: None; MP: SJ1-3534N; Package: None; CUI_purchase_URL: https://www.cuidevices.com/product/interconnect/connectors/audio-connectors/jacks/sj1-353xn-series?utm_source=snapeda.com&utm_medium=referral&utm_campaign=snapedaBOM
J14 = Header 2: Header, 2-Pin; LatestRevisionDate: 17-Jul-2002; LatestRevisionNote: Re-released for DXP Platform.; Publisher: Altium Limited
R1 = Res: Resistor; Published: 8-Jun-2000; LatestRevisionDate: 17-Jul-2002; LatestRevisionNote: Re-released for DXP Platform.; PackageReference: AXIAL-0.3; Publisher: Altium Limited
R2 R4-R6 R8-R11 = Res: SMD resistor; Tolerance: 5%
R3 = Res: Resistor; Value: 470; Published: 8-Jun-2000; LatestRevisionDate: 17-Jul-2002; LatestRevisionNote: Re-released for DXP Platform.; PackageReference: AXIAL-0.3; Publisher: Altium Limited
U2 = PAM8403DR: Stereo Audio Amp; Manufacturer_Name: Diodes Inc.; Datasheet Link: http://docs-emea.rs-online.com/webdocs/1268/0900766b81268cf7.pdf; Height: 1.75mm; Link: https://www.digikey.com/product-detail/en/diodes-incorporated/PAM8403DR/PAM8403DRDICT-ND/8545951; Part Number: PAM8403DR
U3 = NC7WZ16P6X: Buffer, Non-Inverting 2 Element 1 Bit per Element Push-Pull Output SC-88 _SC-70-6_; MF: ON Semiconductor; SnapEDA_Link: https://www.snapeda.com/parts/NC7WZ16P6X/ON%20Semiconductor/view-part/1769774/?ref=snap; Availability: Unavailable; Value: *; Package: SC-70-6 ON Semiconductor; MP: NC7WZ16P6X; Price: None

## Nets that join several sheets
1V8: Power_Supply (5 pins), SPI_To_Ethernet (6 pins), LCD (J8.1)
1V8_CM: Power_Supply (U12.2), CoreBoard (C21.2 Module1.88 Module1.90)
3V3: Power_Supply (19 pins), SPI_To_Ethernet (7 pins), HDMI_MicroUSB (FB14.2), USB_To_Ethernet (16 pins), CoreBoard (9 pins), 4G (FB8#2.2), LCD (J8.2), DIO (7 pins), Audio (7 pins)
3V3_CM: Power_Supply (R45.2), CoreBoard (C22.2 Module1.84 Module1.86)
5V: Power_Supply (19 pins), HDMI_MicroUSB (C41.1 U8.1), USB_To_Ethernet (5 pins), CoreBoard (6 pins), LCD (J8.3), DIO (C38.2 LED4.1 R33.2 U7.30), Audio (FB2.2)
24V: Power_Supply (L1#1.2 R38.1 R40.1), DIO (17 pins)
GLOBAL_EN: Power_Supply (U13.4), CoreBoard (Module1.99)
GND: Power_Supply (85 pins), SPI_To_Ethernet (25 pins), HDMI_MicroUSB (20 pins), USB_To_Ethernet (76 pins), CoreBoard (65 pins), 4G (36 pins), LCD (8 pins), DIO (40 pins), Audio (33 pins)
HDMI_CEC: HDMI_MicroUSB (J6.13), CoreBoard (Module1.151)
HDMI_HPD: HDMI_MicroUSB (J6.19), CoreBoard (Module1.153)
HDMI_SCL: HDMI_MicroUSB (J6.15), CoreBoard (Module1.200)
HDMI_SDA: HDMI_MicroUSB (J6.16), CoreBoard (Module1.199)
HDMI_TX_0_N: HDMI_MicroUSB (J6.9), CoreBoard (Module1.184)
HDMI_TX_0_P: HDMI_MicroUSB (J6.7), CoreBoard (Module1.182)
HDMI_TX_1_N: HDMI_MicroUSB (J6.6), CoreBoard (Module1.178)
HDMI_TX_1_P: HDMI_MicroUSB (J6.4), CoreBoard (Module1.176)
HDMI_TX_2_N: HDMI_MicroUSB (J6.3), CoreBoard (Module1.172)
HDMI_TX_2_P: HDMI_MicroUSB (J6.1), CoreBoard (Module1.170)
HDMI_TX_C_N: HDMI_MicroUSB (J6.12), CoreBoard (Module1.190)
HDMI_TX_C_P: HDMI_MicroUSB (J6.10), CoreBoard (Module1.188)
I2C_SCL1: Power_Supply (IC1.1 IC2.6 R54.2), CoreBoard (Module1.56)
I2C_SDA1: Power_Supply (IC1.4 IC2.5 R53.2), CoreBoard (Module1.58)
PCM_CLK: CoreBoard (Module1.49), Audio (U1.13)
PCM_Data: CoreBoard (Module1.25), Audio (U1.14)
PCM_FS: CoreBoard (Module1.26), Audio (U1.15)
PWM0_0: CoreBoard (Module1.31), Audio (U3.1 U3.3)
SPI0_CE0_N: SPI_To_Ethernet (U14.26), CoreBoard (Module1.39)
SPI0_MISO: SPI_To_Ethernet (R61.1 U14.27), CoreBoard (Module1.40)
SPI0_MOSI: SPI_To_Ethernet (R62.1 U14.31), CoreBoard (Module1.44)
SPI0_P_RESET: SPI_To_Ethernet (T1.B), CoreBoard (Module1.24)
SPI0_SCLK: SPI_To_Ethernet (U14.28), CoreBoard (Module1.38)
GPIO4: CoreBoard (Module1.54), DIO (U6.9 U6.10)
GPIO14: CoreBoard (Module1.55), DIO (U7.11 U7.12)
GPIO15: CoreBoard (Module1.51), DIO (U7.9 U7.10)
GPIO16: CoreBoard (Module1.29), DIO (U7.3 U7.4)
GPIO17: CoreBoard (Module1.50), DIO (U7.1 U7.2)
GPIO22: CoreBoard (Module1.46), DIO (U6.11 U6.12)
GPIO23: CoreBoard (Module1.47), DIO (U6.13 U6.14)
GPIO27: CoreBoard (Module1.48), DIO (U6.15 U6.16)
MIPI_CLK_N: CoreBoard (Module1.187), LCD (J8.11)
MIPI_CLK_P: CoreBoard (Module1.189), LCD (J8.12)
MIPI_PWM: CoreBoard (Module1.28), LCD (J8.21)
MIPI_RESET: CoreBoard (Module1.30), LCD (J8.22)
MIPI_STBYB: CoreBoard (Module1.37), LCD (J8.23)
MIPI_TD0_N: CoreBoard (Module1.175), LCD (J8.5)
MIPI_TD0_P: CoreBoard (Module1.177), LCD (J8.6)
MIPI_TD1_N: CoreBoard (Module1.181), LCD (J8.8)
MIPI_TD1_P: CoreBoard (Module1.183), LCD (J8.9)
MIPI_TD2_N: CoreBoard (Module1.193), LCD (J8.14)
MIPI_TD2_P: CoreBoard (Module1.195), LCD (J8.15)
MIPI_TD3_N: CoreBoard (Module1.194), LCD (J8.17)
MIPI_TD3_P: CoreBoard (Module1.196), LCD (J8.18)
MIPI_TP_I2C_SCL: CoreBoard (Module1.80), LCD (J8.25)
MIPI_TP_I2C_SDA: CoreBoard (Module1.82), LCD (J8.24)
MIPI_TP_INT: CoreBoard (Module1.41), LCD (J8.27)
MIPI_TP_RST: CoreBoard (Module1.45), LCD (J8.26)
USB0_N: HDMI_MicroUSB (U10.2), CoreBoard (Module1.103)
USB0_P: HDMI_MicroUSB (U10.1), CoreBoard (Module1.105)
USB1_3_N: USB_To_Ethernet (U15.3), 4G (R79#2.2)
USB1_3_P: USB_To_Ethernet (U15.4), 4G (R80#2.2)
USB_CM_N: HDMI_MicroUSB (U10.4), USB_To_Ethernet (U15.58)
USB_CM_P: HDMI_MicroUSB (U10.5), USB_To_Ethernet (U15.59)
USB_Ethernet_RST: USB_To_Ethernet (U15.12), CoreBoard (Module1.100)
USB_OTG: HDMI_MicroUSB (R36.1 R37.1 U9.5 U10.10), CoreBoard (Module1.101)